# EAGLE design main (EAGLE 6.5.0)
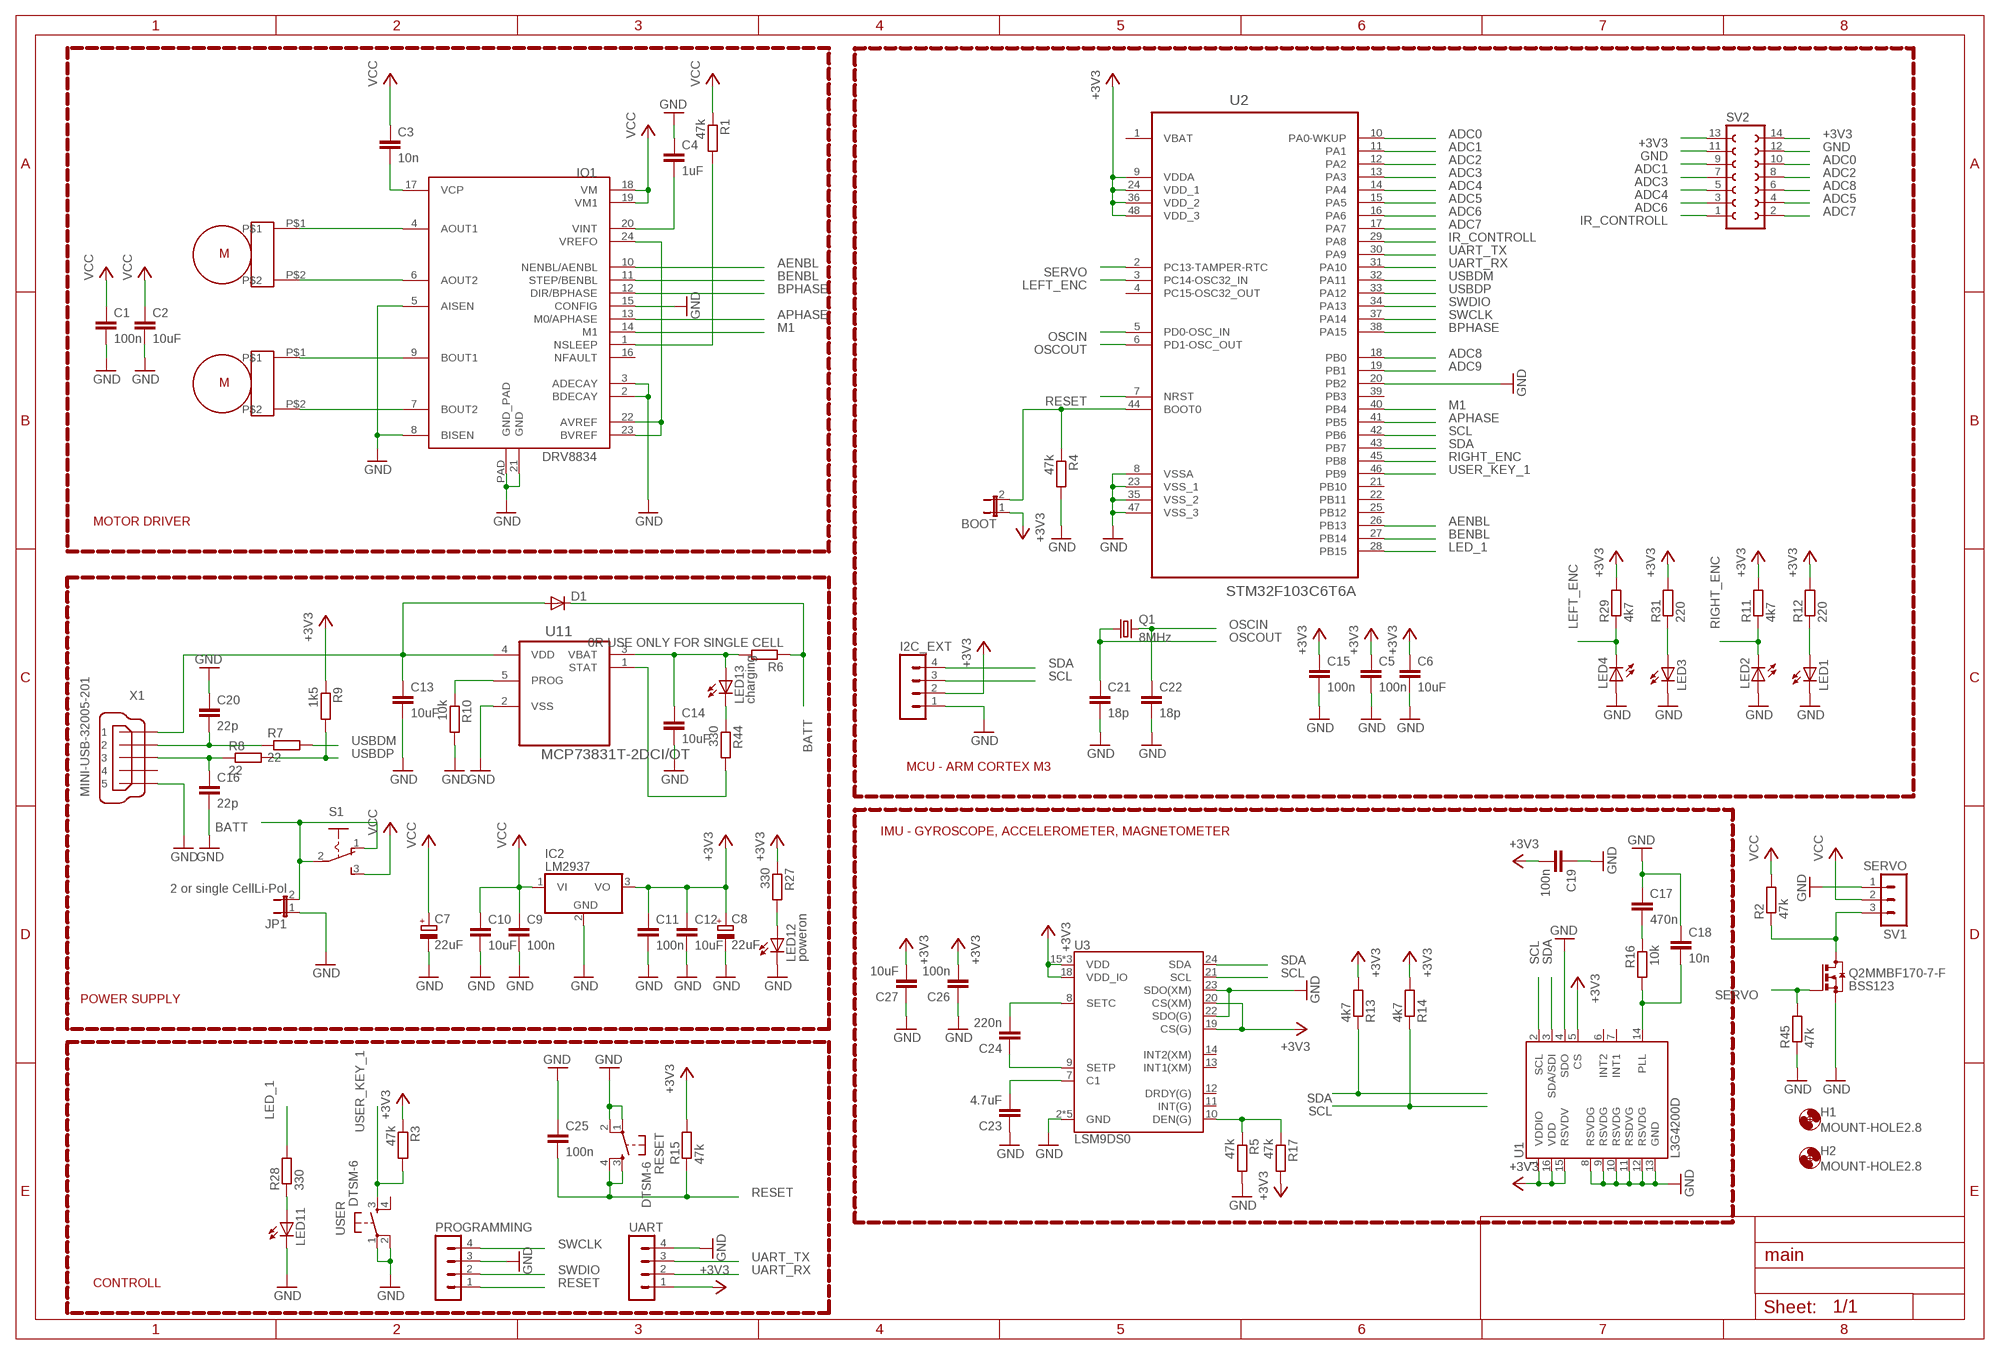
[diagram p0: schematic, sheet 1, part 1 of 2]
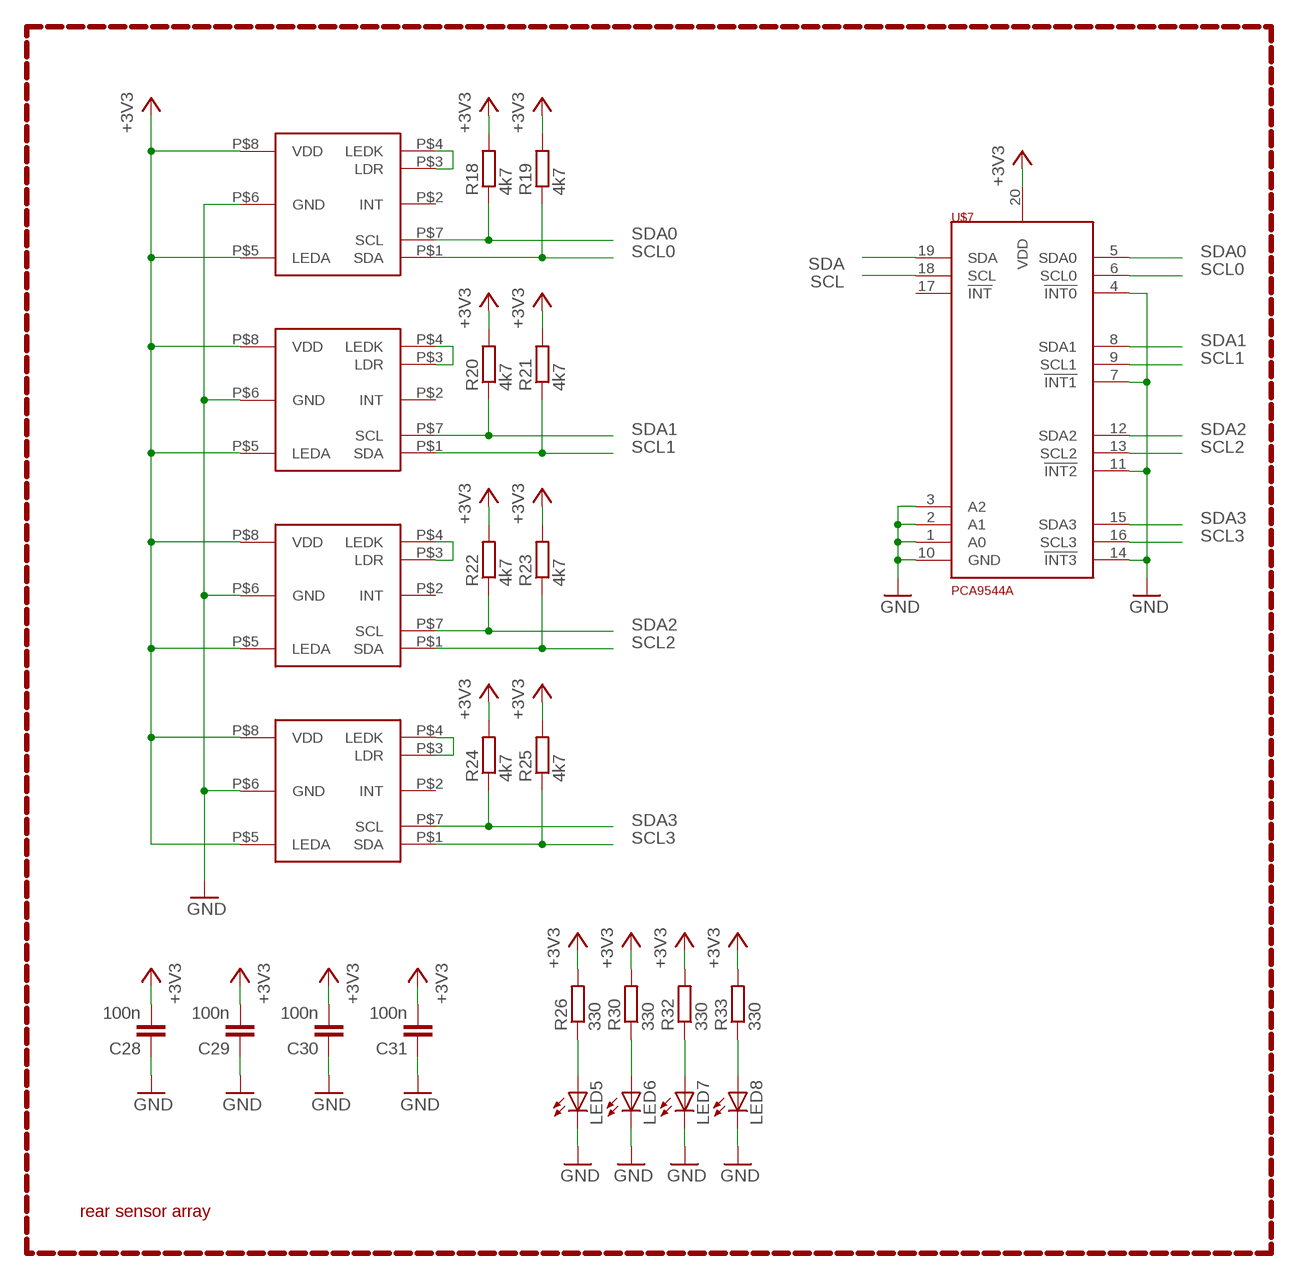
[diagram p1: schematic, sheet 1, part 2 of 2]

## Parts
BOOT  JP1E  [JP1]
C1  100n  C-EUC1206  [C1206]
C2  10uF  C-EUC1206  [C1206]
C3  10n  C-EUC1206  [C1206]
C4  1uF  C-EUC1206  [C1206]
C5  100n  C-EUC0805  [C0805]
C6  10uF  C-EUC0805  [C0805]
C7  22uF  CPOL-EU153CLV-0505  [153CLV-0505]
C8  22uF  CPOL-EU153CLV-0505  [153CLV-0505]
C9  100n  C-EUC0805  [C0805]
C10  10uF  C-EUC0805  [C0805]
C11  100n  C-EUC0805  [C0805]
C12  10uF  C-EUC0805  [C0805]
C13  10uF  C-EUC0805  [C0805]
C14  10uF  C-EUC0805  [C0805]
C15  100n  C-EUC0805  [C0805]
C16  22p  C-EUC0805  [C0805]
C17  470n  C-EUC0805  [C0805]
C18  10n  C-EUC0805  [C0805]
C19  100n  C-EUC0805  [C0805]
C20  22p  C-EUC0805  [C0805]
C21  18p  C-EUC0805  [C0805]
C22  18p  C-EUC0805  [C0805]
C23  4.7uF  C-EUC0805  [C0805]
C24  220n  C-EUC0805  [C0805]
C25  100n  C-EUC0805  [C0805]
C26  100n  C-EUC0805  [C0805]
C27  10uF  C-EUC0805  [C0805]
C28  100n  C-EUC0805  [C0805]
C29  100n  C-EUC0805  [C0805]
C30  100n  C-EUC0805  [C0805]
C31  100n  C-EUC0805  [C0805]
D1  DIODE-SMB  [SMB]
H1  MOUNT-HOLE2.8  [2,8]
H2  MOUNT-HOLE2.8  [2,8]
I2C_EXT  MA04-1  [MA04-1]
IC2  LM2937  [TO263-3]
IO1  DRV8834  [DRV8834_PCK]
JP1  2 or single CellLi-Pol  JP1E  [JP1]
LED1  LEDCHIPLED_1206  [CHIPLED_1206]
LED2  LEDCHIPLED_1206  [CHIPLED_1206]
LED3  LEDCHIPLED_1206  [CHIPLED_1206]
LED4  LEDCHIPLED_1206  [CHIPLED_1206]
LED5  LEDCHIPLED_1206  [CHIPLED_1206]
LED6  LEDCHIPLED_1206  [CHIPLED_1206]
LED7  LEDCHIPLED_1206  [CHIPLED_1206]
LED8  LEDCHIPLED_1206  [CHIPLED_1206]
LED11  LEDCHIPLED_1206  [CHIPLED_1206]
LED12  poweron  LEDCHIPLED_1206  [CHIPLED_1206]
LED13  charging  LEDCHIPLED_1206  [CHIPLED_1206]
PROGRAMMING  MA04-1  [MA04-1]
Q1  8MHz  CRYSTALCTS406  [CTS406]
Q2MMBF170-7-F  BSS123  [SOT23]
R1  47k  R-EU_M1206  [M1206]
R2  47k  R-EU_M0805  [M0805]
R3  47k  R-EU_M0805  [M0805]
R4  47k  R-EU_M0805  [M0805]
R5  47k  R-EU_M0805  [M0805]
R6  0R USE ONLY FOR SINGLE CELL  R-EU_M1206  [M1206]
R7  22  R-EU_M0805  [M0805]
R8  22  R-EU_M0805  [M0805]
R9  1k5  R-EU_M0805  [M0805]
R10  10k  R-EU_M0805  [M0805]
R11  4k7  R-EU_M0805  [M0805]
R12  220  R-EU_M0805  [M0805]
R13  4k7  R-EU_M0805  [M0805]
R14  4k7  R-EU_M0805  [M0805]
R15  47k  R-EU_M0805  [M0805]
R16  10k  R-EU_M0805  [M0805]
R17  47k  R-EU_M0805  [M0805]
R18  4k7  R-EU_M0805  [M0805]
R19  4k7  R-EU_M0805  [M0805]
R20  4k7  R-EU_M0805  [M0805]
R21  4k7  R-EU_M0805  [M0805]
R22  4k7  R-EU_M0805  [M0805]
R23  4k7  R-EU_M0805  [M0805]
R24  4k7  R-EU_M0805  [M0805]
R25  4k7  R-EU_M0805  [M0805]
R26  330  R-EU_M0805  [M0805]
R27  330  R-EU_M0805  [M0805]
R28  330  R-EU_M0805  [M0805]
R29  4k7  R-EU_M0805  [M0805]
R30  330  R-EU_M0805  [M0805]
R31  220  R-EU_M0805  [M0805]
R32  330  R-EU_M0805  [M0805]
R33  330  R-EU_M0805  [M0805]
R44  330  R-EU_M0805  [M0805]
R45  47k  R-EU_M0805  [M0805]
RESET  DTSM-6  [DTSM-6]
S1  255SB  [255SB]
SV1  SERVO  MA03-1  [MA03-1]
SV2  FE07-2  [FE07-2]
U1  L3G4200D  [LGA16-4X4]
U2  STM32F103C6T6A  [QFP50P900X900X160-48N]
U3  LSM9DS0  [LGA-24]
U11  MCP73831T-2DCI/OT  [SOT95P270X145-5N]
U$1  MICRO_METAL_GEAR_MOTOR  [MICRO_METAL_GEAR_MOTOR]
U$2  MICRO_METAL_GEAR_MOTOR  [MICRO_METAL_GEAR_MOTOR]
U$3  APDS9950  [APDS9950]
U$4  APDS9950  [APDS9950]
U$5  APDS9950  [APDS9950]
U$6  APDS9950  [APDS9950]
U$7  DSSCIRCUITS_PCA9544A  [DSSCIRCUITS_TSSOP20]
UART  MA04-1  [MA04-1]
USER  DTSM-6  [DTSM-6]
X1  MINI-USB-32005-201  [32005-201]

## Nets
+3V3: BOOT.1 C5.1 C6.1 C8.+ C11.1 C12.1 C15.1 C19.2 C26.2 C27.2 C28.2 C29.2 C30.2 C31.2 I2C_EXT.2 IC2.3(VO) R3.1 R9.1 R11.2 R12.2 R13.2 R14.2 R15.2 R17.2 R18.2 R19.2 R20.2 R21.2 R22.2 R23.2 R24.2 R25.2 R26.2 R27.1 R29.2 R30.2 R31.2 R32.2 R33.2 SV2.13 SV2.14 U1.1(VDDIO) U1.5(CS) U1.15(RSVDV) U1.16(VDD) U2.9(VDDA) U2.24(VDD_1) U2.36(VDD_2) U2.48(VDD_3) U3.15(VDD) U3.16(VDD) U3.17(VDD) U3.18(VDD_IO) U3.19(CS(G)) U3.20(CS(XM)) U$3.P$5(LEDA) U$3.P$8(VDD) U$4.P$5(LEDA) U$4.P$8(VDD) U$5.P$5(LEDA) U$5.P$8(VDD) U$6.P$5(LEDA) U$6.P$8(VDD) U$7.20(VDD) UART.1
ADC0: SV2.10 U2.10(PA0-WKUP)
ADC1: SV2.9 U2.11(PA1)
ADC2: SV2.8 U2.12(PA2)
ADC3: SV2.7 U2.13(PA3)
ADC4: SV2.5 U2.14(PA4)
ADC5: SV2.4 U2.15(PA5)
ADC6: SV2.3 U2.16(PA6)
ADC7: SV2.2 U2.17(PA7)
ADC8: SV2.6 U2.18(PB0)
ADC9: U2.19(PB1)
AENBL: IO1.10(NENBL/AENBL) U2.26(PB13)
APHASE: IO1.13(M0/APHASE) U2.41(PB5)
BATT: D1.C JP1.2 R6.1 S1.1(O) S1.2(P)
BENBL: IO1.11(STEP/BENBL) U2.27(PB14)
BPHASE: IO1.12(DIR/BPHASE) U2.38(PA15)
GND: C1.2 C2.2 C4.1 C5.2 C6.2 C7.- C8.- C9.2 C10.2 C11.2 C12.2 C13.2 C14.2 C15.2 C16.2 C17.1 C18.1 C19.1 C20.1 C21.2 C22.2 C23.1 C25.1 C26.1 C27.1 C28.1 C29.1 C30.1 C31.1 I2C_EXT.1 IC2.2(GND) IO1.2(BDECAY) IO1.3(ADECAY) IO1.5(AISEN) IO1.8(BISEN) IO1.15(CONFIG) IO1.21(GND) IO1.PAD(GND_PAD) JP1.1 LED1.C LED2.A LED3.C LED4.A LED5.C LED6.C LED7.C LED8.C LED11.C LED12.C PROGRAMMING.3 Q2MMBF170-7-F.2(S) R4.2 R5.2 R10.2 R45.1 RESET.1 RESET.2 SV1.1 SV2.11 SV2.12 U1.4(SDO) U1.8(RSVDG) U1.9(RSVDG) U1.10(RSVDG) U1.11(RSDVG) U1.12(RSVDG) U1.13(GND) U2.8(VSSA) U2.20(PB2) U2.23(VSS_1) U2.35(VSS_2) U2.47(VSS_3) U3.2(GND) U3.3(GND) U3.4(GND) U3.5(GND) U3.6(GND) U3.22(SDO(G)) U3.23(SDO(XM)) U11.2(VSS) U$3.P$6(GND) U$4.P$6(GND) U$5.P$6(GND) U$6.P$6(GND) U$7.1(A0) U$7.2(A1) U$7.3(A2) U$7.4(!INT0) U$7.7(!INT1) U$7.10(GND) U$7.11(!INT2) U$7.14(!INT3) UART.4 USER.1 USER.2 X1.5
IR_CONTROLL: SV2.1 U2.29(PA8)
LED_1: R28.2 U2.28(PB15)
LEFT_ENC: LED4.C R29.1 U2.3(PC14-OSC32_IN)
M1: IO1.14(M1) U2.40(PB4)
N$1: IO1.4(AOUT1) U$1.P$1
N$2: IO1.6(AOUT2) U$1.P$2
N$3: IO1.9(BOUT1) U$2.P$1
N$4: IO1.7(BOUT2) U$2.P$2
N$5: C3.2 IO1.17(VCP)
N$6: C23.2 U3.7(C1)
N$7: C24.2 U3.8(SETC)
N$8: IO1.22(AVREF) IO1.23(BVREF) IO1.24(VREFO)
N$9: IO1.1(NSLEEP) R1.2
N$13: C24.1 U3.9(SETP)
N$14: LED3.A R31.1
N$15: LED1.A R12.1
N$16: BOOT.2 R4.1 U2.44(BOOT0)
N$17: R44.2 U11.1(STAT)
N$18: R5.1 R17.1 U3.10(DEN(G))
N$19: C18.2 R16.2 U1.14(PLL)
N$20: C17.2 R16.1
N$21: U$6.P$3(LDR) U$6.P$4(LEDK)
N$22: C4.2 IO1.20(VINT)
N$23: LED12.A R27.2
N$24: LED13.C R44.1
N$25: U$5.P$3(LDR) U$5.P$4(LEDK)
N$26: Q2MMBF170-7-F.3(D) R2.1 SV1.3
N$27: U$4.P$3(LDR) U$4.P$4(LEDK)
N$28: U$3.P$3(LDR) U$3.P$4(LEDK)
N$33: LED11.A R28.1
N$38: LED5.A R26.1
N$39: LED6.A R30.1
N$40: LED7.A R32.1
N$41: LED8.A R33.1
N$53: C14.1 LED13.A R6.2 U11.3(VBAT)
N$54: R10.1 U11.5(PROG)
N$55: C20.2 R7.1 X1.2
N$56: C16.1 R8.1 X1.3
N$57: C13.1 D1.A U11.4(VDD) X1.1
OSCIN: C22.1 Q1.3 U2.5(PD0-OSC_IN)
OSCOUT: C21.1 Q1.1 U2.6(PD1-OSC_OUT)
RESET: C25.2 PROGRAMMING.1 R15.1 RESET.3 RESET.4 U2.7(NRST)
RIGHT_ENC: LED2.C R11.1 U2.45(PB8)
SCL: I2C_EXT.3 R14.1 U1.2(SCL) U2.42(PB6) U3.21(SCL) U$7.18(SCL)
SCL0: R19.1 U$3.P$1(SDA) U$7.6(SCL0)
SCL1: R21.1 U$4.P$1(SDA) U$7.9(SCL1)
SCL2: R23.1 U$5.P$1(SDA) U$7.13(SCL2)
SCL3: R25.1 U$6.P$1(SDA) U$7.16(SCL3)
SDA: I2C_EXT.4 R13.1 U1.3(SDA/SDI) U2.43(PB7) U3.24(SDA) U$7.19(SDA)
SDA0: R18.1 U$3.P$7(SCL) U$7.5(SDA0)
SDA1: R20.1 U$4.P$7(SCL) U$7.8(SDA1)
SDA2: R22.1 U$5.P$7(SCL) U$7.12(SDA2)
SDA3: R24.1 U$6.P$7(SCL) U$7.15(SDA3)
SERVO: Q2MMBF170-7-F.1(G) R45.2 U2.2(PC13-TAMPER-RTC)
SWCLK: PROGRAMMING.4 U2.37(PA14)
SWDIO: PROGRAMMING.2 U2.34(PA13)
UART_RX: U2.31(PA10) UART.2
UART_TX: U2.30(PA9) UART.3
USBDM: R7.2 U2.32(PA11)
USBDP: R8.2 R9.2 U2.33(PA12)
USER_KEY_1: R3.2 U2.46(PB9) USER.3
VCC: C1.1 C2.1 C3.1 C7.+ C9.1 C10.1 IC2.1(VI) IO1.18(VM) IO1.19(VM1) R1.1 R2.2 S1.3(S) SV1.2
Unconnected: IO1.16(NFAULT) U1.6(INT2) U1.7(INT1) U2.4(PC15-OSC32_OUT) U2.21(PB10) U2.22(PB11) U2.25(PB12) U2.39(PB3) U3.11(INT(G)) U3.12(DRDY(G)) U3.13(INT1(XM)) U3.14(INT2(XM)) U$3.P$2(INT) U$4.P$2(INT) U$5.P$2(INT) U$6.P$2(INT) U$7.17(!INT) USER.4 X1.4

## Notes on the sheet
- MOTOR DRIVER
- MCU - ARM CORTEX M3
- IMU - GYROSCOPE, ACCELEROMETER, MAGNETOMETER
- rear sensor array
- POWER SUPPLY
- CONTROLL

## Power pins joined to a net without a drawn wire
VBAT: U2.1(VBAT)

## Library data of the parts
BOOT JP1 = jumper:JP1E: JUMPER
C1-C6 C9-C31 = resistor:C-EU: CAPACITOR, European symbol
C7 C8 = resistor:CPOL-EU: POLARIZED CAPACITOR, European symbol
D1 = diode:DIODE-: DIODE
H1 H2 = holes:MOUNT-HOLE: MOUNTING HOLE with drill center marker
I2C_EXT PROGRAMMING UART = con-lstb:MA04-1: PIN HEADER; OC_FARNELL: unknown; OC_NEWARK: unknown
IC2 = linear:LM2937: LM2937-2.5, LM2937-3.3 400mA and 500mA Voltage Regulators Source: http://cache.national.com/ds/LM/LM2937-2.5.pdf
IO1 = yellow_car:DRV8834
LED1-LED8 LED11-LED13 = led:LED: LED OSRAM: - CHIPLED LG R971, LG N971, LY N971, LG Q971, LY Q971, LO R971, LY R971 LH N974, LH R974 LS Q976, LO Q976, LY Q976 LO Q996 - Hyper CHIPLED LW Q18S LB Q993, LB Q99A, LB R99A - SideLED LS A670, LO A670, LY A670, LG A670, LP A670 LB A673, LV A673, LT A673, LW A673 LH A674 LY A675 LS A676, LA A676, LO A676, LY A676, LW A676 LS A679, LY A679, LG A679 - Hyper Micro SIDELED® LS Y876, LA Y876, LO Y876, LY Y876 LT Y87S - SmartLED LW L88C, LW L88S LB L89C, LB L89S, LG L890 LS L89K, LO L89K, LY L89K LS L896, LA L896, LO L896, LY L896 - TOPLED LS T670, LO T670, LY T670, LG T670, LP T670 LSG T670, LSP T670, LSY T670, LOP T670, LYG T670 LG T671, LOG T671, LSG T671 LB T673, LV T673, LT T673, LW T673 LH T674 LS T676, LA T676, LO T676, LY T676, LB T676, LH T676, LSB T676, LW T676 LB T67C, LV T67C, LT T67C, LS T67K, LO T67K, LY T67K, LW E67C LS E67B, LA E67B, LO E67B, LY E67B, LB E67C, LV E67C, LT E67C LW T67C LS T679, LY T679, LG T679 LS T770, LO T770, LY T770, LG T770, LP T770 LB T773, LV T773, LT T773, LW T773 LH T774 LS E675, LA E675, LY E675, LS T675 LS T776, LA T776, LO T776, LY T776, LB T776 LHGB T686 LT T68C, LB T68C - Hyper Mini TOPLED® LB M676 - Mini TOPLED Santana® LG M470 LS M47K, LO M47K, LY M47K Source: http://www.osram.convergy.de LUXEON: - LUMILED® LXK2-PW12-R00, LXK2-PW12-S00, LXK2-PW14-U00, LXK2-PW14-V00 LXK2-PM12-R00, LXK2-PM12-S00, LXK2-PM14-U00 LXK2-PE12-Q00, LXK2-PE12-R00, LXK2-PE12-S00, LXK2-PE14-T00, LXK2-PE14-U00 LXK2-PB12-K00, LXK2-PB12-L00, LXK2-PB12-M00, LXK2-PB14-N00, LXK2-PB14-P00, LXK2-PB14-Q00 LXK2-PR12-L00, LXK2-PR12-M00, LXK2-PR14-Q00, LXK2-PR14-R00 LXK2-PD12-Q00, LXK2-PD12-R00, LXK2-PD12-S00 LXK2-PH12-R00, LXK2-PH12-S00 LXK2-PL12-P00, LXK2-PL12-Q00, LXK2-PL12-R00 Source: www.luxeon.com KINGBRIGHT: KA-3528ASYC Source: www.kingbright.com
Q1 = crystal:CRYSTAL: CRYSTAL; OC_FARNELL: unknown; OC_NEWARK: unknown
Q2MMBF170-7-F = transistor-small-signal:BSS123: N-CHANNEL MOS FET
R1-R33 R44 R45 = resistor:R-EU_: RESISTOR, European symbol
RESET USER = switch-tact:DTSM-6
S1 = switch:255SB: SLIDING SWITCH Distributor Buerklin, 11G810
SV1 = con-lstb:MA03-1: PIN HEADER; OC_FARNELL: unknown; OC_NEWARK: unknown
SV2 = con-lsta:FE07-2: FEMALE HEADER; OC_FARNELL: unknown; OC_NEWARK: unknown
U1 = my_parts:L3G4200D: L3G4200D Three-axis, digital output gyroscope The L3G4200D is a low-power three-axis angular rate sensor, has a full scale of ±250/±500/±2000 dps and is capable of measuring rates with a user-selectable bandwidth. It includes a sensing element and an IC interface capable of providing the measured angular rate to the external world through a digital interface (I2C/SPI). Package: 4x4x1.1 LGA-16 (LGA16-4x4.PAC)
U2 = stm32f103_lqfp48:STM32F103C6T6A: MCU, 32BIT, 32K FLASH, 48LQFP; MPN: STM32F103C6T6A; OC_FARNELL: 1972391; OC_NEWARK: 72T2643; PACKAGE: 48LQFP; SUPPLIER: STMicroelectronics
U3 = SparkFun-DigitalIC:LSM9DS0: LSM9DS0 3D Accelerometer, 3D Gyroscope, 3D Magnetomter Features: 3 acceleration channels, 3 angular rate channels, 3 magnetic field channels ±2/±4/±6/±8/±16 g linear acceleration full scale ±2/±4/±8/±12 gauss magnetic full scale ±245/±500/±2000 dps angular rate full scale 16-bit data output SPI / I2C serial interfaces Analog supply voltage 2.4 V to 3.6 V Power-down mode / low-power mode Programmable interrupt generators Embedded self-test Embedded temperature sensor Embedded FIFO Position and motion detection functions Click/double-click recognition
U11 = Microchip-MCP73831T-2DCI_OT:MCP73831T-2DCI/OT: Li-Polymer Charge Management Controllers, SOT23-5; MPN: MCP73831T-2DCI/OT; OC_FARNELL: 1840935; OC_NEWARK: 84R6271; PACKAGE: SOT23-5; SUPPLIER: Microchip
U$1 U$2 = pololu:MICRO_METAL_GEAR_MOTOR
U$3-U$6 = my_parts:APDS9950
U$7 = PCA9544A Breakout PCB:DSSCIRCUITS_PCA9544A
X1 = con-cypressindustries:MINI-USB-: MINI USB-B Conector Source: www.cypressindustries.com; OC_FARNELL: unknown; OC_NEWARK: unknown

## Board
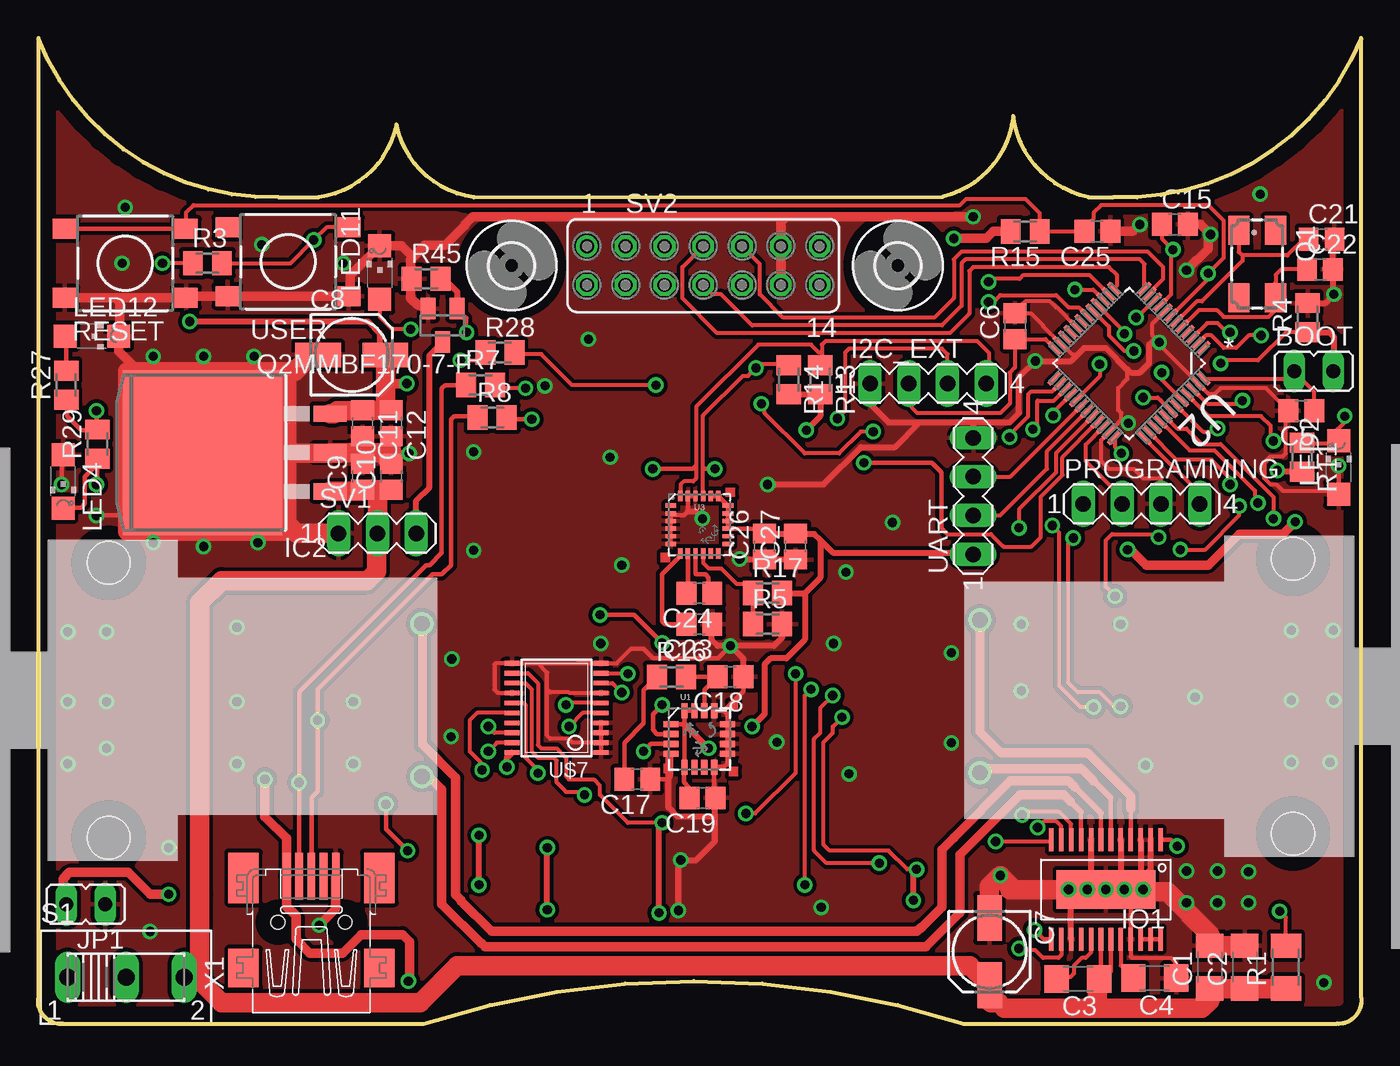
[diagram p2: board, top side]
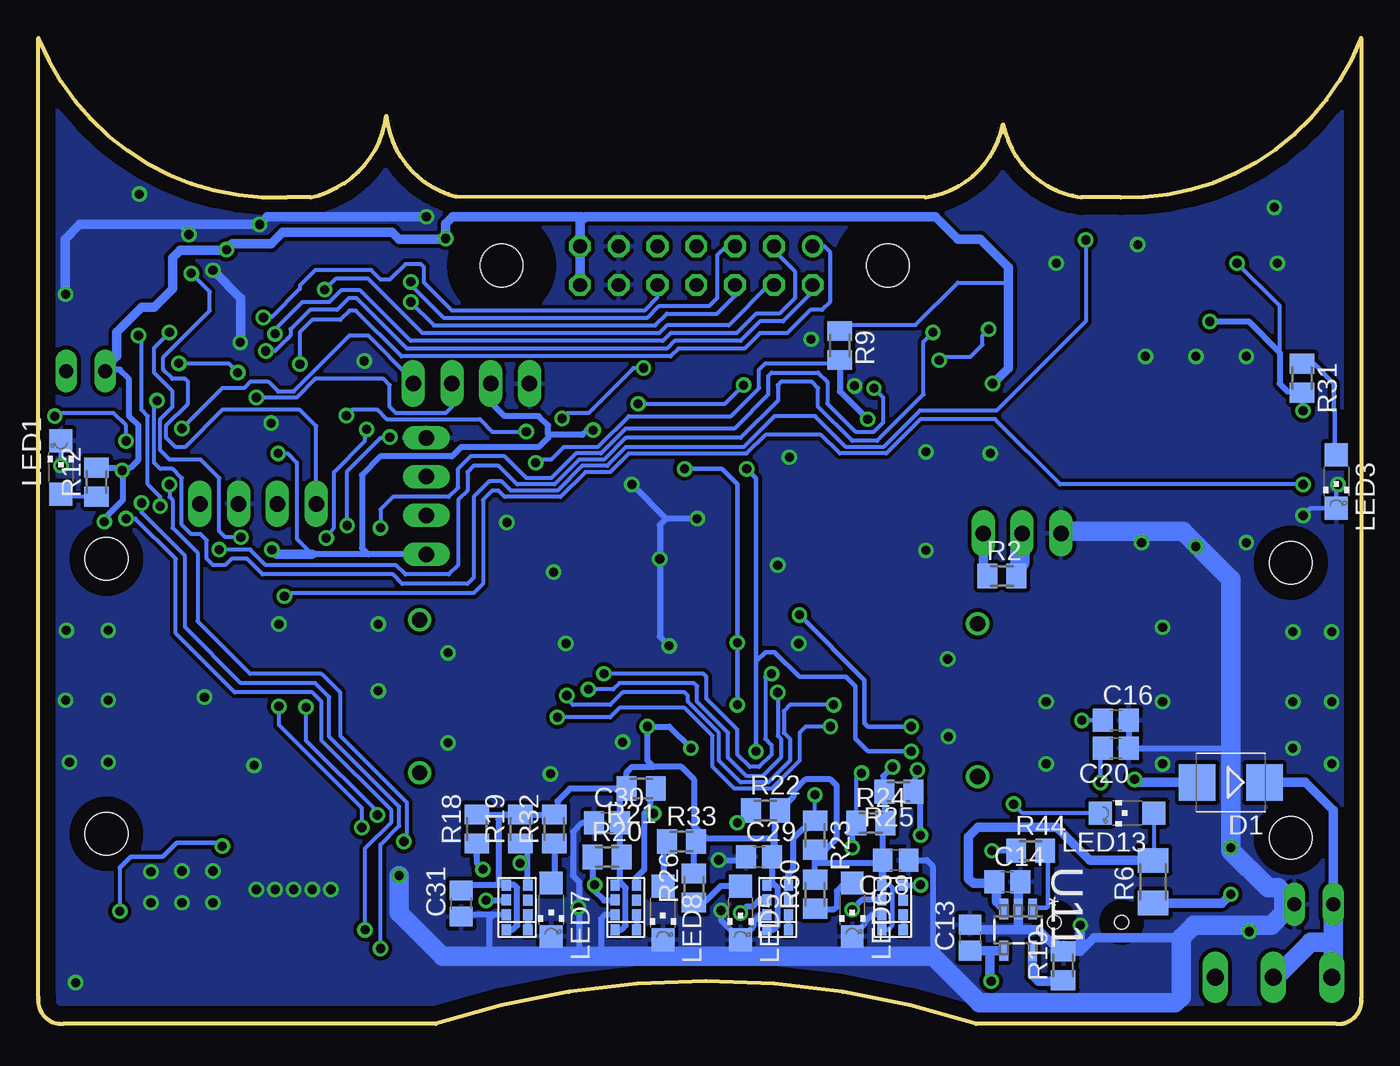
[diagram p3: board, bottom side, seen from below]

Size 86.64 x 64.52 mm. Coordinates in mm from the lower left corner, seen from the top.
Outline: 1.64,0.01 25.23,0.01 arc-36 60.61,0.01 85,0.01 arc103 86.62,1.76 86.62,64.52 arc-71 70.37,54.11 68.79,54.11 arc-71 63.84,59.44 arc-71 59.24,54.16 28.53,54.11 arc-71 23.45,58.88 arc-71 18.35,54.11 15.76,54.11 arc-71 0.01,64.52 0.01,1.68 arc103 1.64,0.01
Copper layers (1*16): Top 0.035mm / dielectric 1.5mm / Bottom 0.035mm
Design rules "default *": minimum track width 10mil, minimum drill 24mil, track to track 10mil, track to pad 10mil, pad to pad 10mil, via to via 10mil, smd to smd 10mil, copper to edge 40mil, drill to drill 8mil, minimum pad ring 10mil, minimum via ring 8mil, stop-mask expansion 4mil, vias tented up to drill 0mil, thermal gap 10mil

### Footprints (pad centres in the part's own frame; a part is rotated, then mirrored left to right if it is on the bottom)
JP1 = drill 0.914 long: 1 0,-1.27; 2 0,1.27
C1206 = smd 1.6 x 1.8: 1 -1.4,0; 2 1.4,0
C0805 = smd 1.3 x 1.5: 1 -0.85,0; 2 0.85,0
153CLV-0505 = smd 3 x 1.6: + 2.2,0; - -2.2,0
SMB = smd 2.4 x 2.4: A 2.2,0; C -2.2,0
2,8 = hole 2.8: 0,0
MA04-1 = drill 1.016 long: 1 -3.81,0; 2 -1.27,0; 3 1.27,0; 4 3.81,0
TO263-3 = smd 1.067 x 2.159: 1 -2.54,-5.791; 2 0,-5.791; 3 2.54,-5.791 | smd 10.8 x 10.41: TAB 0,2.54
DRV8834_PCK = smd 0.3 x 1.5: 1 -3.575,-3.25; 2 -2.925,-3.25; 3 -2.275,-3.25; 4 -1.625,-3.25; 5 -0.975,-3.25; 6 -0.325,-3.25; 7 0.325,-3.25; 8 0.975,-3.25; 9 1.625,-3.25; 10 2.275,-3.25; 11 2.925,-3.25; 12 3.575,-3.25; 13 3.575,3.25; 14 2.925,3.25; 15 2.275,3.25; 16 1.625,3.25; 17 0.975,3.25; 18 0.325,3.25; 19 -0.325,3.25; 20 -0.975,3.25; 21 -1.625,3.25; 22 -2.275,3.25; 23 -2.925,3.25; 24 -3.575,3.25 | smd 6.452 x 2.54: PAD 0,0
CHIPLED_1206 = smd 1.5 x 1.5: A 0,-1.75; C 0,1.75
CTS406 = smd 1.9 x 1.4: 1 -2.2,-1.2; 2 2.2,-1.2; 3 2.2,1.2; 4 -2.2,1.2
SOT23 = smd 1 x 1.4: 1 -0.95,-1.1; 2 0.95,-1.1; 3 0,1.1
M1206 = smd 1.6 x 2: 1 -1.4,0; 2 1.4,0
M0805 = smd 1.3 x 1.6: 1 -0.95,0; 2 0.95,0
DTSM-6 = smd 1.55 x 1.3: 1 -3.975,2.25; 2 3.975,2.25; 3 -3.975,-2.25; 4 3.975,-2.25
255SB = drill 1.118 long: 1 -3.81,0; 2 0,0; 3 3.81,0
MA03-1 = drill 1.016 long: 1 -2.54,0; 2 0,0; 3 2.54,0
FE07-2 = drill 0.914: 1 -7.62,1.27 | drill 0.914 octagon: 2 -7.62,-1.27; 3 -5.08,1.27; 4 -5.08,-1.27; 5 -2.54,1.27; 6 -2.54,-1.27; 7 0,1.27; 8 0,-1.27; 9 2.54,1.27; 10 2.54,-1.27; 11 5.08,1.27; 12 5.08,-1.27; 13 7.62,1.27; 14 7.62,-1.27
LGA16-4X4 = smd 1 x 0.4: 1 -1.85,0.975; 2 -1.85,0.325; 3 -1.85,-0.325; 4 -1.85,-0.975; 9 1.85,-0.975; 10 1.85,-0.325; 11 1.85,0.325; 12 1.85,0.975 | smd 0.4 x 1: 5 -0.975,-1.85; 6 -0.325,-1.85; 7 0.325,-1.85; 8 0.975,-1.85; 13 0.975,1.85; 14 0.325,1.85; 15 -0.325,1.85; 16 -0.975,1.85
QFP50P900X900X160-48N = smd 1.041 x 0.279: 1 -4.166,2.743; 2 -4.166,2.261; 3 -4.166,1.753; 4 -4.166,1.245; 5 -4.166,0.762; 6 -4.166,0.254; 7 -4.166,-0.254; 8 -4.166,-0.762; 9 -4.166,-1.245; 10 -4.166,-1.753; 11 -4.166,-2.261; 12 -4.166,-2.743; 25 4.166,-2.743; 26 4.166,-2.261; 27 4.166,-1.753; 28 4.166,-1.245; 29 4.166,-0.762; 30 4.166,-0.254; 31 4.166,0.254; 32 4.166,0.762; 33 4.166,1.245; 34 4.166,1.753; 35 4.166,2.261; 36 4.166,2.743 | smd 0.279 x 1.041: 13 -2.743,-4.166; 14 -2.261,-4.166; 15 -1.753,-4.166; 16 -1.245,-4.166; 17 -0.762,-4.166; 18 -0.254,-4.166; 19 0.254,-4.166; 20 0.762,-4.166; 21 1.245,-4.166; 22 1.753,-4.166; 23 2.261,-4.166; 24 2.743,-4.166; 37 2.743,4.166; 38 2.261,4.166; 39 1.753,4.166; 40 1.245,4.166; 41 0.762,4.166; 42 0.254,4.166; 43 -0.254,4.166; 44 -0.762,4.166; 45 -1.245,4.166; 46 -1.753,4.166; 47 -2.261,4.166; 48 -2.743,4.166
LGA-24 = smd 0.7 x 0.29: 1 -1.875,1.25; 2 -1.875,0.75; 3 -1.875,0.25; 4 -1.875,-0.25; 5 -1.875,-0.75; 6 -1.875,-1.25; 13 1.875,-1.25; 14 1.875,-0.75; 15 1.875,-0.25; 16 1.875,0.25; 17 1.875,0.75; 18 1.875,1.25 | smd 0.29 x 0.7: 7 -1.25,-1.875; 8 -0.75,-1.875; 9 -0.25,-1.875; 10 0.25,-1.875; 11 0.75,-1.875; 12 1.25,-1.875; 19 1.25,1.875; 20 0.75,1.875; 21 0.25,1.875; 22 -0.25,1.875; 23 -0.75,1.875; 24 -1.25,1.875
SOT95P270X145-5N = smd 1.321 x 0.559: 1 -1.372,0.94; 2 -1.372,0; 3 -1.372,-0.94; 4 1.372,-0.94; 5 1.372,0.94
MICRO_METAL_GEAR_MOTOR = drill 1: P$1 -5,1; P$2 5,1 | hole 2.8: -9,21.5; 9,21.5
APDS9950 = smd 0.6 x 0.72: P$1 0.7,1.4; P$2 0.7,0.43; P$3 0.7,-0.54; P$4 0.7,-1.51; P$5 -0.7,-1.5; P$6 -0.7,-0.53; P$7 -0.7,0.44; P$8 -0.7,1.41
DSSCIRCUITS_TSSOP20 = smd 0.305 x 0.991: 1 -2.925,-2.918; 2 -2.275,-2.918; 3 -1.625,-2.918; 4 -0.975,-2.918; 5 -0.325,-2.918; 6 0.325,-2.918; 7 0.975,-2.918; 8 1.625,-2.918; 9 2.275,-2.918; 10 2.925,-2.918; 11 2.925,2.918; 12 2.275,2.918; 13 1.625,2.918; 14 0.975,2.918; 15 0.325,2.918; 16 -0.325,2.918; 17 -0.975,2.918; 18 -1.625,2.918; 19 -2.275,2.918; 20 -2.925,2.918
32005-201 = smd 3.1 x 0.5: 1 3,1.6; 2 3,0.8; 3 3,0; 4 3,-0.8; 5 3,-1.6 | smd 2.5 x 2: M1 -3,-4.45; M2 -3,4.45 | smd 3.3 x 2: M3 2.9,4.45; M4 2.9,-4.45 | hole 0.9: 0,2.2; 0,-2.2

### Placement (x,y rotation side)
BOOT  83.53,42.73 270 top
C1  76.72,3.72 90 top
C2  79,3.72 90 top
C3  68.08,2.95 180 top
C4  73.11,3 180 top
C5  82.71,40.14 180 top
C6  63.97,45.68 90 top
C7  62.29,4.73 270 top
C8  20.53,43.8 0 top
C9  21.25,35.82 90 top
C10  23.12,35.82 90 top
C11  21.25,39.33 270 top
C12  23.12,39.33 270 top
C13  25.61,5.65 90 bottom
C14  23.18,9.3 0 bottom
C15  74.43,52.33 0 top
C16  16.06,19.87 0 bottom
C17  39.23,16.01 180 top
C18  45.32,22.71 180 top
C19  43.5,14.79 180 top
C20  16.06,18.04 180 bottom
C21  84.03,51.37 0 top
C22  83.93,49.38 0 top
C23  43.29,26.17 180 top
C24  43.29,28.2 180 top
C25  69.35,51.87 180 top
C26  47.56,31.25 90 top
C27  49.59,31.25 90 top
C28  30.49,10.73 180 bottom
C29  39.43,10.93 0 bottom
C30  49.39,13.16 0 bottom
C31  58.94,7.88 90 bottom
D1  8.55,15.81 180 bottom
H1  31,49.64 0 top
H2  56.3,49.64 0 top
I2C_EXT  58.28,41.92 0 top
IC2  13.32,37.4 90 top
IO1  69.91,8.8 180 top
JP1  3.11,7.83 90 top
LED1  85.15,36.43 0 bottom
LED2  85.15,36.43 0 top
LED3  1.64,35.52 180 bottom
LED4  1.64,35.52 180 top
LED5  40.65,7.27 180 bottom
LED6  33.34,7.47 180 bottom
LED7  53.05,7.47 180 bottom
LED8  45.73,7.27 180 bottom
LED11  22.36,49.18 0 top
LED12  3.52,45.02 270 top
LED13  15.33,13.8 90 bottom
PROGRAMMING  72.25,34.04 0 top
Q1  79.82,49.74 270 top
Q2MMBF170-7-F  26.48,45.73 180 top
R1  81.7,3.72 90 top
R2  23.53,29.32 0 bottom
R3  11.09,49.79 0 top
R4  83.12,46.23 90 top
R5  47.76,26.17 0 top
R6  13.63,9.3 90 bottom
R7  28.97,41.82 0 top
R8  29.73,39.68 0 top
R9  34.15,44.41 270 bottom
R10  19.52,3.82 90 bottom
R11  82.76,37.09 270 top
R12  82.81,35.47 90 bottom
R13  51.22,42.17 270 top
R14  49.13,42.17 270 top
R15  64.63,51.87 180 top
R16  41.46,22.71 0 top
R17  47.76,28.2 0 top
R18  57.92,12.76 90 bottom
R19  55.08,12.76 90 bottom
R20  49.39,10.93 0 bottom
R21  47.15,15.4 180 bottom
R22  39.03,13.98 0 bottom
R23  35.77,12.35 270 bottom
R24  32.12,13.16 0 bottom
R25  30.29,15.2 180 bottom
R26  43.7,8.9 90 bottom
R27  1.84,41.82 90 top
R28  30.24,43.95 0 top
R29  3.87,37.95 90 top
R30  35.77,8.49 90 bottom
R31  3.87,42.27 270 bottom
R32  52.84,12.76 90 bottom
R33  44.51,11.94 0 bottom
R44  21.65,11.34 0 bottom
R45  25.41,48.77 0 top
RESET  5.7,49.79 180 top
S1  5.75,3.05 0 top
SV1  22.21,32.11 0 top
SV2  43.55,49.64 0 top
U1  43.29,18.65 0 top
U2  71.44,43.24 225 top
U3  43.29,32.67 0 top
U11  22.46,6.15 270 bottom
U$1  60.67,21.44 270 top
U$2  26.12,21.19 90 top
U$3  55.28,7.68 0 bottom
U$4  48.17,7.68 0 bottom
U$5  38.21,7.68 0 bottom
U$6  30.69,7.68 0 bottom
U$7  33.95,20.68 90 top
UART  61.22,34.55 90 top
USER  16.37,49.89 180 top
X1  17.89,6.66 90 top

### Tracks (layer width: path | path; a pad name or v marks a point on that pad's centre or on a via)
+3V3  (via drill 0.6)
  Top 0.254: 1.91,40.8 R27.1 | R3.1 v8.14,49.79 | C15.1 73.58,51.4 v74.31,50.68 | 74.43,50.55 v74.31,50.68 | I2C_EXT.2 56.91,41.81 56.91,40.65 57.57,39.99 63,39.99 63.61,40.6 63.61,42.63 63.97,42.98 C6.1 65.97,44.83 U2.24 | U2.36 70.51,38.35 70.51,37.76 v70.93,37.34 | U2.48 81.76,42.23 BOOT.1 82.26,42.68 83.53,41.41 83.53,40.18 C5.1 | U2.9 74.18,47.74 74.18,50.55 v74.31,50.68
  Top 0.305: 22.11,43.69 22.36,43.44 22.38,43.44 C8.+ | 1.91,40.8 1.91,39.77 2.8,38.87 3.84,38.87 R29.2 3.82,38.95 v3.82,40.14 | U3.20 U3.19 U3.18 U3.17 U3.16 U3.15 47.44,32.42 C26.2 | C19.2 42.65,15.44 42.28,15.81 42.28,16.76 U1.5 42.32,19.67 | 42.32,19.67 U1.16 U1.15 | 42.32,19.67 42.28,19.63 U1.1
  Top 0.406: v9.92,45.98 21.6,45.98 22.36,45.22 22.36,44.17 C8.+ | 49.07,41.15 R14.2 R13.2 51.22,39.78 v50.3,38.87 | R11.2 81.22,36.14 v81.14,36.23 | C26.2 C27.2 49.63,32.06 50.81,32.06 51.22,31.65 | R17.2 50.2,28.2 | 51.22,31.65 51.22,29.22 50.2,28.2 | 50.2,28.2 50.2,25.15 48.98,23.93 47.97,23.93 47.56,23.53 47.56,20.28 v46.75,19.46 | 51.22,31.65 52.03,30.84 61.12,30.84 UART.1 | v30.69,16.82 30.69,17.42 U$7.20 | 42.28,19.63 42.32,19.63 v43.9,18.04
  Top 0.61: v24.14,41.92 22.73,41.92 | R15.2 62.55,51.87 62.09,51.42 v59.95,51.42 | v71.33,31.05 71.54,31.05 72.55,30.03 76.62,30.03 78.65,32.06 81.49,32.06 v82.31,32.87
  Top 1.27: IC2.3 19.37,39.94 19.57,40.14 21.21,40.14 C11.1 C12.1 22.73,40.57 22.73,41.92 C8.+
  Bottom 0.254: 5.34,43.95 5.34,47 v8.14,49.79 | v70.93,37.34 70.32,37.34 69.71,36.73 69.71,31.76 68.69,30.74 | 51.12,51.82 51.17,51.77 | 33.74,45.76 29.18,45.76 26.43,48.52 23.33,48.52 23.12,48.72 | R25.2 31.24,15.67
  Bottom 0.305: R31.2 3.87,40.19 v3.82,40.14 | U$6.P$5 30.97,6.18 30.69,6.46 30.69,8.9 30.9,9.1 31.38,9.1 U$6.P$8
  Bottom 0.406: v9.92,45.98 7.38,45.98 5.34,43.95 5.34,41.92 4.84,41.41 3.96,41.41 R31.2 | 56.91,40.65 56.91,41.81 I2C_EXT.2 57.01,40.7 56.09,39.78 53.86,39.78 53.25,39.17 53.25,38.56 | UART.1 65.03,30.74 | 53.25,38.56 53.25,38.36 53.86,37.75 58.94,37.75 59.55,37.14 64.22,37.14 65.44,35.92 65.44,31.15 65.03,30.74 | 33.74,45.76 R9.1 | 65.03,30.74 68.69,30.74 | v82.31,32.87 82.31,33.08 81.09,34.3 81.09,36.18 v81.14,36.23 81.33,36.41 R12.2 80.59,36.41 80.07,36.94 80.07,39.17 80.68,39.78 80.68,42.22 81.29,42.83 82.15,42.83 BOOT.1 | v50.3,38.87 50.71,38.87 51.01,38.56 53.25,38.56 | U$5.P$5 38.49,6.18 38.21,6.46 38.21,8.9 38.42,9.1 | 38.42,9.1 38.9,9.1 U$5.P$8 | 43.09,9.51 R26.2 43.7,11.81 R33.2 | U$4.P$5 48.45,6.18 48.17,6.46 48.17,8.9 48.37,9.1 | 48.37,9.1 48.86,9.1 U$4.P$8 | U$3.P$5 55.56,6.18 55.28,6.46 55.28,8.9 55.48,9.1 55.97,9.1 U$3.P$8 56.5,9.09 | 56.5,9.09 58.58,9.09 C31.2 | 35.77,10.52 R30.2 35.77,10.73 34.35,12.15 34.35,15.6 34.76,16.01 36.38,16.01 37.2,15.2 37.2,14.86 R22.2 38.42,13.64 38.42,11.09 C29.2 | 35.77,10.52 R23.2 | C29.2 38.48,11.03 38.48,11.94 38.68,12.15 42.89,12.15 | C29.2 38.58,9.27 38.42,9.1 | 35.77,10.52 31.51,10.52 31.39,10.41 U$6.P$8 31.34,9.14 C28.2 31.34,12.79 R24.2 R25.2 31.3,15.26 31.3,16.21 v30.69,16.82 | 43.09,11.47 R33.2 | R33.2 43.29,11.94 43.09,12.15 42.89,12.15 | R19.2 56.16,13.71 56.5,13.37 56.5,9.09 | R18.2 R19.2 | R19.2 R32.2 52.64,13.91 52.64,14.59 51.83,15.4 R21.2 | 48.37,9.1 48.54,9.27 48.54,10.83 R20.2 48.54,11.03 C30.2 48.54,14.96 R21.2 | R21.2 48.1,16.48 47.76,16.82 46.34,16.82 | 42.89,12.15 43.7,12.96 43.7,16.01 44.51,16.82 46.34,16.82
  Bottom 0.406: 46.34,16.82 46.75,17.23 v46.75,19.46 45.32,19.46 v43.9,18.04
  Bottom 0.61: 50.94,52.71 51.17,52.48 51.17,51.77 SV2.13 SV2.14 | 50.94,52.71 50.81,52.84 27.9,52.84 26.43,51.37 24.95,51.37 23.12,49.54 23.12,48.72 23.12,42.93 v24.14,41.92 | 50.94,52.71 51.06,52.84 59.5,52.84 59.95,52.38 v59.95,51.42 60.01,51.37 63,51.37 63.46,51.82 70.62,51.82 71.38,51.06 73.92,51.06 v74.31,50.68 74.36,50.63 77.35,50.63 77.84,50.15 77.84,48.11 79.06,46.89 79.87,46.89 81.49,45.27 81.49,43.69 82.1,43.08 82.1,42.88 BOOT.1 | 68.69,30.74 71.03,30.74 v71.33,31.05
ADC0  (via drill 0.6)
  Top 0.254: v71.89,46.23 71.95,46.23 U2.10
  Bottom 0.254: v71.89,46.23 71.84,46.29 71.33,46.29 69.5,48.11 69.5,48.32 68.49,49.33 64.83,49.33 64.22,48.72 63.61,48.72 62.6,49.74 61.58,49.74 61.38,49.54 61.38,48.52 59.55,46.69 46.95,46.69 46.09,47.56 SV2.10
ADC1
  Top 0.254: U2.11 72.78,47.89 73.67,48.77 73.67,49.54 72.65,50.55 60.46,50.55 59.95,50.04 59.95,47.5 58.68,46.23 48.78,46.23 47.25,47.76 47.25,49.74 SV2.9
ADC2
  Top 0.254: U2.12 72.44,49.75 72.15,50.04 60.72,50.04 60.46,49.79 60.46,47 59.19,45.73 46.75,45.73 44.71,47.76 44.16,47.76 SV2.8
ADC3
  Top 0.254: U2.13 70.62,48.32 70.62,49.03 70.11,49.54 61.22,49.54 60.97,49.28 60.97,46.49 59.7,45.22 44.46,45.22 42.17,47.5 42.17,49.54 SV2.7
ADC4  (via drill 0.6)
  Top 0.254: U2.14 68.84,49.03 64.53,49.03 64.27,48.77 62.44,48.77 v62.24,48.57
  Bottom 0.254: SV2.5 41.56,50.91 42.17,50.3 42.17,47.5 42.68,47 45.98,47 46.75,46.23 60.11,46.23 61.99,48.11 61.99,48.32 v62.24,48.57
ADC5  (via drill 0.6)
  Top 0.254: v67.88,48.06 69.09,48.06 U2.15
  Bottom 0.254: SV2.4 38.77,48.37 41.41,45.73 45.48,45.73 45.98,45.22 61.48,45.22 65.03,48.77 67.17,48.77 v67.88,48.06
ADC6  (via drill 0.6)
  Top 0.254: v71.13,45.17 71.13,45.3 U2.16
  Bottom 0.254: SV2.3 38.47,50.65 37.09,49.28 37.09,47.5 38.11,46.49 39.63,46.49 40.9,45.22 45.22,45.22 45.73,44.71 62.24,44.71 65.54,48.01 66.81,48.01 67.57,47.25 69.35,47.25 71.13,45.47 v71.13,45.17
ADC7  (via drill 0.6)
  Top 0.254: U2.17 70.11,45.64 70.11,45.07 71.13,44.05 v71.74,44.05
  Bottom 0.254: SV2.2 35.93,47.91 37.86,45.98 39.38,45.98 40.65,44.71 44.97,44.71 45.48,44.2 62.49,44.2 65.8,47.5 66.3,47.5 67.07,46.74 68.84,46.74 70.11,45.47 70.11,45.07 70.32,44.86 70.52,44.66 71.13,44.05 v71.74,44.05
ADC8  (via drill 0.6)
  Top 0.254: v62.24,47.25 62.55,47.25 63,47.71 66.66,47.71 67.47,46.89 68.14,46.89 U2.18
  Bottom 0.254: SV2.6 41.01,47.66 42.17,46.49 45.48,46.49 46.24,45.73 60.72,45.73 v62.24,47.25
AENBL  (via drill 0.6)
  Top 0.254: IO1.10 67.64,13.1 66.86,13.87 64.63,13.87 v64.42,13.67 | U2.26 66.41,41.41 65.03,41.41 64.83,41.21 64.83,39.78 63.66,38.61 63.61,38.61 v63.61,38.41 | v69.1,20.73 68.23,20.73 66.86,22.1 66.86,32.16 v66.41,32.62
  Bottom 0.254: v64.42,13.67 64.42,13.87 69.1,18.55 v69.1,20.73 | v66.41,32.62 66.41,36.18 64.22,38.36 63.66,38.36 v63.61,38.41
APHASE  (via drill 0.6)
  Top 0.254: IO1.13 65.85,5.54 v65.24,6.15 | U2.41 73.84,39.71 74.58,38.97 75.19,38.97 76.21,37.95 77.43,37.95 80.88,34.5 v80.88,33.08
  Bottom 0.254: v65.24,6.15 65.24,11.49 63.51,13.21 63.51,13.98 68.08,18.55 68.08,21.09 68.69,21.7 73.77,21.7 77.63,25.56 77.63,30.44 80.27,33.08 v80.88,33.08
BATT  (via drill 0.6)
  Top 0.61: v8.54,8.49 7.33,8.49 5.9,9.91 2.04,9.91 1.64,9.51 1.64,8.03 JP1.2
  Bottom 0.61: R6.1 9.13,7.9 v8.54,8.49 | D1.C 3.67,15.81 1.84,13.98 JP1.2
  Bottom 1.27: JP1.2 1.84,5.34 | 1.84,5.34 1.84,3.16 S1.1 | S1.2 5.6,3.05 3.31,5.34 1.84,5.34
BENBL  (via drill 0.6)
  Top 0.254: IO1.11 66.99,12.94 66.66,13.27 65.85,13.27 v65.44,12.86 | v65.14,38.92 65.19,38.92 65.44,39.17 65.44,40.8 66.52,40.8 U2.27 | v70.88,20.78 70.42,20.78 69.5,21.7 68.08,21.7 67.47,22.31 67.47,31.5 v67.78,31.81
  Bottom 0.254: v65.44,12.86 65.44,14.13 70.88,19.56 v70.88,20.78 | v65.14,38.92 65.24,38.82 65.24,38.16 67.27,36.13 67.27,32.52 v67.78,31.81
BPHASE  (via drill 0.6)
  Top 0.254: 66.34,11.93 IO1.12 66.24,11.94 v62.7,11.94 | v78.04,35.31 78.04,35.72 76.82,36.94 74.54,36.94 U2.38
  Bottom 0.254: v62.7,11.94 62.7,12.25 62.49,12.45 62.49,14.48 66.86,18.85 66.86,21.7 68.08,22.92 72.76,22.92 76.21,26.37 76.21,30.84 77.84,32.47 77.84,34.3 78.04,34.5 v78.04,35.31
GND  (via drill 0.6)
  Top 0.254: 72.19,8.84 72.31,8.84 v72.35,8.79 | v68.69,8.79 v67.47,8.79 | IO1.21 71.54,4.43 71.64,4.32 74.18,4.32 74.43,4.07 74.43,3.08 C4.1 | U2.47 | U2.8 72.96,45.84 72.96,45.07 73.16,44.86 73.16,44.71 73.29,44.58 | 68.08,43.85 67.68,43.85 66.94,44.58 U2.23 65.8,45.68 65.8,45.72 65.03,46.49 64,46.49 C6.2 64.42,46.98 64.42,47.1 64.63,47.3 66.25,47.3 66.66,46.89 66.7,46.89 U2.20 | U2.35 70.09,38.74 | U2.35 70.93,39.53 70.93,39.99 70.72,40.19 70.72,41.61 71.33,42.22 71.33,42.83 | U2.35 69.61,38.21 69.61,36.84 70.11,36.33 71.74,36.33 72.35,35.72 73.37,35.72 73.57,35.52 73.57,34.09 PROGRAMMING.3 | U2.47 76.66,41.21 77.02,41.21 77.43,41.61 80.39,41.61 C5.2 | 73.29,44.58 U2.47 | 73.29,44.58 73.31,44.61 v73.42,44.61 | 81.9,40.1 C5.2 | C5.2 81.7,39.97 81.7,37.34 81.49,37.14 80.68,37.14 80.27,36.73 80.27,35.72 80.68,35.31 81.09,35.31 81.49,34.91 84.93,34.91 LED2.A | U$7.14 30.13,21.66 29.88,21.9 29.88,23.53 29.96,23.61 U$7.11 32.73,23.61 | 32.73,23.61 U$7.10 | U$7.10 35.24,23.61 | U$7.2 35,18.41 34.76,18.65 33.54,18.65 33.34,18.85 33.34,21.9 | U$7.2 U$7.3 U$7.4 | U$7.2 U$7.1 | U$7.7 34.8,21.66 34.76,21.7 33.54,21.7 33.34,21.9 | 45.12,24.54 v45.32,24.75 | 33.34,21.9 33.34,23 32.73,23.61 | U$7.10 37.89,23.61 38.82,24.54
  Top 0.305: 70.52,8.59 70.32,8.39 | 71.54,8.79 71.74,8.79 72.84,9.89 | 71.54,8.79 v71.13,8.79 71.05,8.79 70.89,8.96 | 67.98,8.69 68.08,8.79 v68.69,8.79 69.1,8.79 | 71.54,8.79 | 71.54,8.19 IO1.21 | v1.53,35.31 1.53,37.16 LED4.A | v3.82,33.28 5.85,33.28 | LED2.A v85.15,36.53 | 54.37,41.81 I2C_EXT.1 | U3.6 U3.5 U3.4 U3.3 U3.2 41.56,33.28 42.28,33.28 42.54,33.55 U3.23 U3.22 | U1.13 44.9,20.5 | 44.9,20.5 45.12,20.28 45.12,19.65 U1.12 U1.11 U1.10 U1.9 45.14,17.05 44.92,16.82 44.29,16.82 U1.8 44.27,14.87 C19.1 44.31,14.75 44.31,14.18 | C18.1 46.17,21.78 44.9,20.5 | U1.4 41.44,16.21 41.24,16.01 C17.1 | 38.82,24.54 39.63,24.54 40.24,23.93 44.51,23.93 v45.32,24.75 | 44.31,13.77 44.1,13.57
  Top 0.406: 71.74,8.79 71.54,8.59 71.54,8.19 72.19,8.84 IO1.3 | IO1.2 72.84,10.09 71.54,8.79 | IO1.5 70.89,8.96 70.52,8.59 | IO1.15 67.64,8.35 67.98,8.69 | IO1.8 68.94,8.96 69.1,8.79 | C21.2 84.78,51.26 C22.2 84.78,47.82 v84.85,47.76 84.27,47.18 R4.2 | I2C_EXT.1 54.47,40.6 55.69,39.38 57.72,39.38 | 57.72,39.38 61.17,39.38 | 61.17,39.38 63.61,39.38 64.22,39.99 64.22,42.32 v65.29,43.39 67.63,43.39 68.08,43.85 68.49,44.25 69.91,44.25 71.33,42.83 71.54,42.63 72.15,42.63 72.76,43.24 72.76,44.46 73.16,44.86 | UART.4 61.22,39.33 61.17,39.38 | v24.29,37.34 23.38,37.34 23.07,37.65 | C27.1 C26.1 45.97,30.4 v45.93,30.44 | v45.32,24.75 44.51,24.75 44.1,25.15 44.1,26.13 C23.1 | R5.2 48.71,25.29 48.17,24.75 v45.32,24.75 | 42.54,33.55 43.03,33.55 v43.5,33.08 | C18.1 46.17,23.9 v45.32,24.75 | v47.76,35.31 51.42,35.31 53.86,37.75 56.09,37.75 57.72,39.38 | v41.92,7.42 41.92,10.57 v42.07,10.73 43.09,10.73 44.31,11.94 44.31,13.77 44.31,14.18 | 44.1,13.57 41.87,13.57 41.26,14.18 41.26,17.49 U1.4
  Top 0.61: X1.5 19.49,7.55 v18.4,6.46 | 6.61,42.68 5.27,44.03 LED12.C 5.34,45.09 5.34,47.25 5.05,47.54 | RESET.2 5.05,47.54 | RESET.1 9.15,47.54 | 9.15,47.54 5.05,47.54 | 9.15,47.54 9.26,47.64 USER.2 USER.1 20.44,47.74 20.44,49.01 LED11.C 23.81,50.93 24.55,50.2 | 48.98,52.84 28.46,52.84 27.95,52.33 27.95,52.28 26.63,50.96 25.31,50.96 24.55,50.2 | 24.55,50.2 24.39,50.04 24.39,49.54 24.65,49.28 24.65,48.96 R45.1 | 24.14,48.52 24.71,48.52 R45.1 | C25.1 71.69,51.87 v72.15,52.33 | Q2MMBF170-7-F.2 24.87,47.03 24.39,47.5 24.39,48.71 R45.1 | 48.98,52.84 48.63,52.48 SV2.11 SV2.12 | 48.98,52.84 v61.22,52.84 | 75.28,51.89 C15.2 76.11,52.33 v76.77,51.67 76.62,51.52 76.62,50.76 v75.19,49.33
  Top 1.27: 63.61,8.79 v67.47,8.79 | 69.1,8.79 63.92,8.79 v63,9.71 62.29,9 C7.- | IC2.2 19.82,37.4 | 19.82,37.4 21.09,37.4 | 21.09,37.4 21.35,37.4 | 21.35,37.4 22.82,37.4 | 22.82,37.4 22.87,37.34 22.87,36.92 C10.2 | C11.2 21.24,37.55 21.09,37.4 | C9.2 21.24,37.29 21.35,37.4 | C12.2 23.12,37.7 23.07,37.65 22.82,37.4 | C8.- 17.89,43.8 16.77,42.68 6.61,42.68 5.85,42.68 5.85,33.28 5.85,32.26 16.27,32.26 16.27,32.77 | 16.27,32.77 16.27,37.85 | 16.27,42.42 16.27,37.85 | 16.27,37.85 16.77,37.34 19.77,37.34 19.82,37.4 | SV1.1 16.93,32.11 16.27,32.77 | v72.35,8.79 72.5,8.64 73.92,8.64 76.72,5.85 C1.2 C2.2
  Bottom 0.305: v1.53,35.31 1.64,35.21 LED3.C 3.34,33.77 v3.82,33.28 | v85.15,36.53 LED1.C
  Bottom 0.406: C16.2 C20.1 8.54,18.04 | v45.32,24.75 45.93,25.36 v45.93,30.44 45.93,32.67 45.53,33.08 | v43.5,33.08 45.53,33.08 | 45.53,33.08 v47.76,35.31 | 32.73,4.43 32.93,4.63 LED6.C 32.52,6.54 32.52,6.66 32.04,7.15 U$6.P$6 | 40.45,5.72 LED5.C | LED8.C 45.73,4.63 45.53,4.43 | U$4.P$6 49.51,7.15 49.79,6.86 49.79,4.63 49.59,4.43 | LED7.C 53.05,4.43 | U$3.P$6 56.83,7.15 | 56.83,7.15 57.11,6.86 57.11,4.63 57.31,4.43 | 56.83,7.15 58.82,7.15 C31.1 | C28.1 28.46,10.73 28.05,10.32 28.05,4.43 | 51.22,7.27 51.22,9.3 51.62,9.71 51.62,12.55 51.01,13.16 C30.1 | 51.22,7.27 51.22,4.43 | v51.27,7.63 51.27,7.32 51.22,7.27 | U$5.P$6 39.35,7.15 39.84,6.66 39.84,6.33 LED5.C | v41.92,7.42 41.92,6.79 LED5.C | v42.07,10.73 40.48,10.73 C29.1
  Bottom 0.61: C14.2 22.46,9.16 U11.2 22.46,6.36 22.67,6.15 | R10.2 18.4,4.77 | 19.52,5.14 R10.2 | 22.67,6.15 21.14,6.15 20.23,5.24 19.99,5.24 R10.2 | v18.4,6.46 18.4,4.77 | 77.23,52.33 v72.15,52.33 71.64,52.84 v61.22,52.84 | 77.23,52.33 83.92,52.33 C21.2 84.88,47.8 v84.85,47.76 | 22.67,6.15 25.27,6.15 C13.2 | v75.19,49.33 73.37,47.5 73.37,44.66 v73.42,44.61 | v76.77,51.67 76.77,51.87 77.23,52.33 | 11.8,5.65 17.52,5.65 18.4,4.77
  Bottom 1.27: v63,9.71 63,7.27 60.16,4.43 57.31,4.43 53.05,4.43 51.22,4.43 49.59,4.43 45.53,4.43 32.73,4.43 28.05,4.43 25,1.38 12.2,1.38 11.8,1.78 11.8,5.65 10.98,6.46 5.9,6.46 5.09,7.27 5.09,8.54 | SV1.1 19.52,32.26 11.69,32.26 8.54,29.11 8.54,18.04 v8.54,11.54 8.54,11.33 6.11,8.9 5.45,8.9 5.09,8.54 | 5.09,8.54 JP1.1
  other vias: 77.23,7.93 75.19,7.93 75.19,10.01 77.23,10.01 69.91,8.8 13.02,21.09 4.48,21.09 7.53,31.5 14.39,31.5 14.13,43.69 7.53,43.69 10.83,43.69 10.83,31.25 5.5,49.79 19.98,49.79 4.48,25.66 4.48,18.04 1.94,17.02 1.94,21.09 1.94,25.66 13.02,17.02 20.64,17.02 20.64,21.09 79.26,7.93 79.26,9.96 28.51,37.45 27.04,18.8 59.8,18.4 82.05,21.19 84.85,21.19 84.8,25.76 82.05,25.76 82.05,17.13 84.59,17.13 80.02,54.31 55.94,32.82 36.03,44.81 37.45,37.09 33.18,41.76 5.7,53.45 14.64,51.01 71.38,39.33 27.09,23.88 59.8,24.29 13.02,25.97 75.75,21.39 64.37,21.8 70.88,26.17 64.37,26.17 72.5,16.92 84.19,2.7 7.33,6.05 48.37,18.45 36.84,24.9 52.08,24.9 38.21,30.03 28.51,30.99 52.89,29.57 53.1,16.36
  pour Bottom: -13.2,69.04 95.11,69.04 95.11,-9.19 -13.2,-9.19
  pour Top: -4.66,73.92 89.83,73.92 89.83,-5.94 -4.66,-5.94
IR_CONTROLL  (via drill 0.6)
  Top 0.254: v69.5,43.19 69.5,42.38 U2.29
  Bottom 0.254: SV2.1 35.16,50.91 34.81,50.55 34.81,47.25 35.32,46.74 36.08,46.74 37.6,45.22 39.38,45.22 40.4,44.2 44.71,44.2 45.22,43.69 62.85,43.69 65.85,46.69 66.25,46.69 66.86,46.08 68.69,46.08 69.5,45.27 v69.5,43.19
LED_1  (via drill 0.6)
  Top 0.254: 67.61,41.14 U2.28 66.46,40.02 v66.46,39.82 | v54.67,38.77 53.86,38.77 52.44,37.34 50.2,37.34 47.56,39.99 47.56,40.39 v47.36,40.6 | 31.29,44.25 R28.2 31.29,43.85 32.93,43.85 34.96,41.81 v40.45,41.81
  Bottom 0.254: v66.46,39.82 66.08,40.19 64.42,40.19 63.82,39.58 57.72,39.58 56.91,38.77 v54.67,38.77 | v47.36,40.6 41.67,40.6 v40.45,41.81
LEFT_ENC  (via drill 0.6)
  Top 0.254: LED4.C 1.96,34.09 1.96,33.36 | R29.1 3.87,35.36 v3.82,35.31 | v70.52,28 69.91,28.61 69.91,31.65 70.32,32.06 73.16,32.06 v73.37,31.86 | U2.3 76.56,45.88 77.23,45.88 77.84,45.27 v78.04,45.27
  Top 0.305: 1.64,34.09 LED4.C 1.66,33.79 2.8,33.79 3.06,34.04 3.06,35.82 3.87,36.63 R29.1
  Bottom 0.254: v3.82,35.31 19.72,35.31 23.99,39.58 28.86,39.58 31.1,37.34 34.15,37.34 35.37,38.56 39.02,38.56 40.24,37.34 47.97,37.34 49.18,36.13 50.81,36.13 52.44,34.5 56.09,34.5 56.5,34.91 56.91,34.91 57.52,34.3 57.52,28.81 58.13,28.2 70.32,28.2 v70.52,28 | v73.37,31.86 74.38,31.86 74.79,32.26 74.79,35.72 76.01,36.94 78.04,36.94 78.65,37.55 78.65,39.58 77.84,40.39 77.84,41.41 79.06,42.63 79.06,44.25 v78.04,45.27
M1  (via drill 0.6)
  Top 0.254: IO1.14 66.99,4.5 66.81,4.32 65.8,4.32 65.29,4.83 64.32,4.83 v64.22,4.93 | U2.40 73.53,39.41 75.4,37.55 77.02,37.55 79.66,34.91 79.66,34.3 v79.87,34.09
  Bottom 0.254: v79.87,34.09 79.87,33.48 77.02,30.64 77.02,25.97 73.37,22.31 68.49,22.31 67.57,21.39 67.57,18.8 63,14.23 63,12.96 64.22,11.74 v64.22,4.93
N$1
  Top 0.305: IO1.4 71.54,14.08
  Top 0.406: 71.54,14.08
  Top 0.61: 71.54,14.08 71.54,14.89 68.69,17.74 63.05,17.74 61.67,19.12 U$1.P$1
N$2
  Top 0.305: IO1.6 70.24,14.77
  Top 0.406: 70.24,14.77 69.1,15.91
  Top 0.61: 69.1,15.91 68.29,16.72 68.26,16.7 61.92,16.7 U$1.P$2
N$3
  Top 0.305: IO1.9 68.29,13.87
  Top 0.406: 68.29,13.87 67.57,14.59 67.47,14.69
  Top 0.61: 67.57,14.59 67.17,14.99 64.27,14.99 60.36,11.08 60.36,7.27 58.13,5.04 29.27,5.04 29.04,5.26 28.99,5.26 26.43,7.83 26.43,15.37 25.61,16.19 U$2.P$1
N$4
  Top 0.305: IO1.7 69.59,13.79
  Top 0.406: 69.59,13.79 67.68,15.7
  Top 0.61: 67.88,15.5 67.68,15.7 67.47,15.91 63.66,15.91 59.95,12.2 59.95,12.17 59.19,11.41 59.19,7.65 57.87,6.33 57.82,6.33 57.54,6.05 29.68,6.05 27.7,8.03 27.7,8.08 27.34,8.44 27.34,16.11 25.16,18.29 25.16,26.16 U$2.P$2
N$5
  Top 0.254: IO1.17 68.94,4.67 68.59,4.32 68.34,4.32 67.83,3.82 67.83,3.31 67.57,3.05 66.78,3.05 C3.2
N$6
  Top 0.305: U3.7 42.04,30.61 40.85,29.42 40.85,26.37 41.06,26.17 C23.2
N$7
  Top 0.305: U3.8 42.54,28.3 C24.2
N$8
  Top 0.305: IO1.24 IO1.23 IO1.22
N$9  (via drill 0.6)
  Top 0.254: R1.2 81.7,6.97 v81.29,7.37
  Top 0.305: IO1.1 74.18,12.04 v74.58,11.64
  Bottom 0.254: 81.29,10.22 v81.29,7.37
  Bottom 0.305: 81.29,10.22 80.58,10.93 78.5,10.93 77.58,11.84 74.79,11.84 v74.58,11.64
N$13
  Top 0.305: U3.9 43.04,29.47 43.09,29.42 43.7,29.42 43.9,29.22 43.9,28.44 C24.1
N$14
  Bottom 0.254: 1.76,37.14 LED3.A 1.74,37.37
  Bottom 0.305: 1.74,37.37 1.74,40.09 1.79,40.14 1.79,41.92 3.09,43.22 R31.1
N$15
  Bottom 0.254: 83.1,34.51 84.99,34.51 LED1.A
  Bottom 0.305: 85.08,34.75 LED1.A
  Bottom 0.406: R12.1 83.1,34.51 | 85.13,34.7 LED1.A
N$16  (via drill 0.6)
  Top 0.254: R4.1 81.71,45.28 79.87,43.44 77.63,43.44 v77.43,43.24 | v73.57,42.63 73.57,42.18 U2.44 | 84.85,42.98 84.85,42.78 BOOT.2
  Top 0.406: R4.1 84.53,45.28 84.85,44.96 84.85,42.98
  Bottom 0.254: v77.43,43.24 74.18,43.24 v73.57,42.63
N$17
  Bottom 0.254: U11.1 21.42,7.52 21.35,7.6
  Bottom 0.305: 21.52,7.6 21.35,7.6 20.61,7.6 20.53,7.68 20.53,10.96 R44.2
N$18
  Top 0.254: R17.1 46.2,28.81 45.73,28.81 44.71,29.83 43.9,29.83 43.54,30.19 U3.10
  Top 0.305: 46.34,28.67 R17.1 R5.1
N$19
  Top 0.305: U1.14 43.62,21.86 C18.2 R16.2
N$20
  Top 0.305: C17.2 38.38,18.41 39.63,19.67 39.63,21.84 R16.1
N$21
  Bottom 0.406: U$6.P$3 U$6.P$4
N$22
  Top 0.254: IO1.20 70.89,3.83 C4.2
N$23
  Top 0.305: R27.2 1.84,44.94 LED12.A
N$24  (via drill 0.6)
  Top 0.305: v22.77,14.38 22.77,12.76 v24.19,11.33
  Bottom 0.254: LED13.C 22.18,13.8 v22.77,14.38
  Bottom 0.406: R44.1 v24.19,11.33
N$25
  Bottom 0.406: U$5.P$4 U$5.P$3
N$26
  Top 0.406: SV1.3 24.75,34.25 25.61,35.11 25.61,43.76 Q2MMBF170-7-F.3
  Bottom 0.61: SV1.3 24.75,29.59 R2.1
N$27
  Bottom 0.406: U$4.P$3 U$4.P$4
N$28
  Bottom 0.406: U$3.P$3 U$3.P$4
N$33  (via drill 0.6)
  Top 0.254: LED11.A 22.36,46.29 23.18,45.47 v24.39,45.47 | v27.65,43.44 28.78,43.44 R28.1
  Bottom 0.254: v24.39,45.47 24.8,45.07 24.8,44.46 25.61,43.64 27.44,43.64 v27.65,43.44
N$38
  Bottom 0.406: LED5.A 41.95,9.02 42.89,8.08 43.56,8.08 R26.1
N$39
  Bottom 0.406: LED6.A 33.82,9.22 34.35,8.69 34.35,7.68 34.55,7.47 35.71,7.47 R30.1
N$40
  Bottom 0.406: R32.1 52.84,9.43 LED7.A
N$41
  Bottom 0.406: LED8.A 45.66,9.09 45.66,11.74 R33.1
N$53
  Bottom 0.254: LED13.A 13.58,10.75 R6.2
  Bottom 0.61: U11.3 23.43,7.52 23.89,7.98 23.89,9.16 C14.1 24.13,9.2 25.41,9.2 25.72,9.51 25.72,12.25 25.11,12.86 19.92,12.86 17.77,10.7 R6.2
N$54
  Bottom 0.61: U11.5 21.52,3.18 21.14,2.8 19.58,2.8 R10.1
N$55  (via drill 0.6)
  Top 0.305: R7.1 26.63,41.81 26.43,41.61 26.43,30.84 25.61,30.03 25.41,30.03 17.08,21.7 v17.08,15.81 17.09,15.79 X1.2
  Bottom 0.305: C20.2 17.08,17.87 v17.08,15.81
N$56  (via drill 0.6)
  Top 0.305: R8.1 28.68,39.78 27.24,39.78 27.04,39.58 27.04,30.03 26.43,29.42 25.82,29.42 18.3,21.9 v18.3,19.87 18.3,15.2 17.89,14.79 X1.3
  Bottom 0.305: C16.1 v18.3,19.87
N$57  (via drill 0.6)
  Top 0.406: 16.27,9.64 X1.1
  Top 0.61: 16.27,9.64 16.27,7.68 16.88,7.07 16.88,5.54 17.79,4.63 19.92,4.63 21.14,5.85 23.86,5.85 24.32,5.39 24.32,2.88 v24.24,2.8 | v14.84,16.01 14.84,13.57 16.27,12.15 16.27,9.69 X1.1
  Bottom 0.61: C13.1 U11.4 24.22,4.78 24.32,4.68 24.32,2.88 v24.24,2.8 | D1.A 14.64,15.81 v14.84,16.01
OSCIN
  Top 0.254: C22.1 81.39,49.38 81.04,49.03 81.04,47.56 Q1.3 | Q1.3 81.02,48.54 | Q1.3 81.02,46.72 80.58,46.29 77.63,46.29 77.18,46.74 76.02,46.74 U2.5
OSCOUT
  Top 0.254: C21.1 82.87,51.37 81.8,50.3 78.86,50.3 | Q1.1 78.62,50.54 78.86,50.3 | 78.86,50.3 78.86,49.95 76.21,47.3 75.86,47.3 U2.6
RESET  (via drill 0.6)
  Top 0.254: 65.63,52.33 R15.1 | 8.36,52.04 RESET.3 9.66,52.05 9.66,53.09 10.17,53.6 60.36,53.6 60.77,54.01 64.63,54.01 65.58,53.06 R15.1 | 68.78,52.27 69.1,52.72 69.1,53.09 69.61,53.6 76.62,53.6 77.63,52.58 77.63,50.15 v76.62,49.13 76.62,48.78 U2.7 | 68.78,52.27 C25.2 | R15.1 68.38,51.87 68.78,52.27
  Top 0.305: RESET.4 RESET.3
  Bottom 0.254: PROGRAMMING.1 68.44,39.12 69.5,40.19 74.58,40.19 77.02,37.75 77.63,37.75 78.24,38.36 78.24,39.17 76.82,40.6 76.82,42.02 77.02,42.22 77.84,42.22 78.45,42.83 78.45,43.64 75.4,46.69 75.4,47.91 v76.62,49.13
RIGHT_ENC  (via drill 0.6)
  Top 0.254: 75.26,41.14 U2.45 76.65,39.78 80.07,39.78 80.68,39.17 80.68,38.36 v80.88,38.16 | v85.56,39.78 85.56,39.4 84.74,38.59 LED2.C 84.98,38 82.8,38
  Top 0.305: LED2.C 85.03,38.18 | 82.8,38 R11.1
  Bottom 0.254: v80.88,38.16 80.88,39.17 81.7,39.99 85.35,39.99 v85.56,39.78
SCL  (via drill 0.6)
  Top 0.254: R14.1 49.07,43.19 47.25,43.19 v47,42.93 46.49,42.42 46.14,42.42 43.54,39.83 43.54,36.33 U3.21 | I2C_EXT.3 59.55,43.85 59.19,44.2 53.1,44.2 52.84,43.95 52.84,40.14 v52.33,39.63 | 73.51,40.8 U2.42 73.31,41 v72.35,41 | U$7.18 29.88,19.06 v29.47,19.46
  Top 0.305: U1.2 40.53,18.98 40.24,19.26 40.24,20.28 v40.85,20.89 | v44.31,36.33 43.54,36.33 | v36.79,26.78 39.02,26.78 v40.85,24.95
  Bottom 0.254: I2C_EXT.3 59.55,40.39 59.95,39.99 63.21,39.99 63.61,40.39 63.61,41.81 64.02,42.22 68.49,42.22 69.71,41 v72.35,41 | v47,42.93 47.66,42.93 50.61,39.99 51.98,39.99 v52.33,39.63
  Bottom 0.305: v40.85,20.89 v40.85,24.95 40.85,35.31 41.87,36.33 v44.31,36.33 | v29.47,19.46 32.32,19.46 32.52,19.67 32.52,22.51 v36.79,26.78
SCL0  (via drill 0.6)
  Top 0.254: U$7.6 34.68,21.01 v34.55,20.89 | v55.08,10.52 51.62,10.52 50.81,11.33 50.81,18.65 51.22,19.06 51.22,20.68 v52.03,21.49
  Bottom 0.254: 54.58,11.31 54.58,11.02 v55.08,10.52 | v34.55,20.89 37.4,20.89 37.81,20.48 37.81,19.06 37.4,18.65 37.4,17.23 38.82,15.81 40.65,15.81 42.07,17.23 42.07,19.06 44.1,21.09 44.1,21.49 44.31,21.7 48.37,21.7 49.18,20.89 51.62,20.89 52.03,21.29 v52.03,21.49
  Bottom 0.406: U$3.P$1 54.58,11.31 R19.1
SCL1  (via drill 0.6)
  Top 0.254: U$7.9 38.58,22.96 v38.62,22.92 | v49.59,22.92 49.59,16.41 46.95,13.77 v46.34,13.77
  Bottom 0.254: R21.1 46.2,14.93 46.54,14.59 | 46.54,14.18 v46.34,13.77 | v38.62,22.92 38.82,22.92 39.02,22.71 39.02,18.65 38.62,18.24 38.62,17.63 39.43,16.82 40.04,16.82 40.85,17.63 40.85,19.26 42.89,21.29 42.89,22.71 43.09,22.92 v49.59,22.92
  Bottom 0.406: U$4.P$1 47.47,9.6 46.95,10.12 46.95,13.77 46.54,14.18 46.54,14.59 46.54,15.06 R21.1
SCL2  (via drill 0.6)
  Top 0.254: v35.77,14.99 35.57,15.2 34.55,15.2 33.94,15.81 33.94,17.23 33.74,17.43 32.73,17.43 32.32,17.84 32.32,21.9 31.91,22.31 U$7.13
  Bottom 0.254: R23.1 v35.77,14.99
  Bottom 0.406: U$5.P$1 37.51,9.8 37.2,10.12 37.2,12.15 36.59,12.76 36.32,12.76 R23.1 35.91,13.16
SCL3  (via drill 0.6)
  Top 0.254: U$7.16 28.74,20.36 28.26,19.87 28.26,17.84 29.07,17.02 v29.07,16.62
  Top 0.406: v28.86,9.1 v28.86,12.35
  Bottom 0.254: R25.1 29.34,15.94
  Bottom 0.305: v29.07,16.62 29.07,16.21 29.34,15.94
  Bottom 0.406: U$6.P$1 29.29,9.08 v28.86,9.1 | v28.86,12.35 28.86,14.72 R25.1
SDA  (via drill 0.6)
  Top 0.254: 51.32,43.95 51.32,44.46 51.57,44.71 61.48,44.71 62.24,43.95 62.24,42.07 I2C_EXT.4 | 51.32,43.95 51.32,43.22 R13.1 | U2.43 76.26,38.77 77.02,38.77 v77.23,38.97 | U3.24 42.07,34.58 42.07,35.31 42.28,35.52 42.89,35.52 43.07,35.7 43.07,36.53 43.09,36.55 43.09,40.39 47.15,44.46 50.61,44.46 51.12,43.95 51.32,43.95 | U$7.19 30.04,18.41 v29.47,17.84
  Top 0.305: U1.3 40.12,18.33 v39.63,17.84 | v40.24,36.33 42.87,36.33 43.07,36.53
  Bottom 0.254: I2C_EXT.4 62.24,42.07 62.24,42.27 65.03,45.07 66.25,45.07 69.91,41.41 70.93,41.41 71.54,42.02 72.76,42.02 73.16,41.61 74.58,41.61 v77.23,38.97
  Bottom 0.305: v39.63,17.84 39.63,23.73 | 39.63,23.73 39.63,35.72 v40.24,36.33 | 39.63,23.73 39.02,24.34 38.42,24.34 36.79,22.71 33.74,22.71 33.13,22.1 33.13,18.65 32.32,17.84 v29.47,17.84
SDA0  (via drill 0.6)
  Top 0.254: U$7.5 35.65,20.36 v34.76,19.46 | v57.52,10.12 56.91,10.12 55.69,11.33 51.83,11.33 51.42,11.74 51.42,18.45 52.03,19.06 52.03,19.46 v52.64,20.07
  Top 0.406: v57.31,8.08 57.31,9.91 v57.52,10.12
  Bottom 0.254: v34.76,19.46 36.38,19.46 36.79,19.06 36.79,17.23 38.62,15.4 41.06,15.4 42.48,16.82 42.48,18.85 44.31,20.68 48.58,20.68 49.18,20.07 v52.64,20.07
  Bottom 0.406: v57.31,8.08 56.01,8.08 U$3.P$7 | 57.92,10.93 R18.1 57.92,10.52 v57.52,10.12
SDA1  (via drill 0.6)
  Top 0.254: v50.2,9.1 50.2,21.49 v50.61,21.9 | U$7.8 37.6,22.31 v38.21,21.7
  Bottom 0.254: R20.1 50.34,9.24 v50.2,9.1 | v50.61,21.9 48.98,21.9 48.58,22.31 43.7,22.31 43.5,22.1 43.5,21.09 41.46,19.06 41.46,17.43 40.24,16.21 39.23,16.21 38.01,17.43 38.01,18.65 38.21,18.85 v38.21,21.7
  Bottom 0.406: R20.1 50.34,8.83 49.59,8.08 48.9,8.08 U$4.P$7
SDA2  (via drill 0.6)
  Top 0.254: v40.85,13.16 38.62,13.16 36.79,14.99 36.79,15.6 36.38,16.01 34.76,16.01 34.55,16.21 34.55,17.43 33.94,18.04 32.93,18.04 32.73,18.24 32.73,22.31 32.08,22.96 U$7.12
  Top 0.406: v40.65,7.27 40.65,12.96 v40.85,13.16
  Bottom 0.254: R22.1 40.04,13.98 v40.85,13.16
  Bottom 0.406: U$5.P$7 39.4,8.12 39.84,7.68 40.24,7.68 v40.65,7.27
SDA3  (via drill 0.6)
  Top 0.254: v32.73,16.41 32.73,16.62 31.91,17.43 31.91,20.89 31.79,21.01 U$7.15
  Top 0.406: v33.34,7.47 v33.34,11.54
  Bottom 0.254: R24.1 33.07,16.07 v32.73,16.41
  Bottom 0.406: U$6.P$7 32.69,8.12 v33.34,7.47 | v33.34,11.54 33.34,12.69 R24.1
SERVO  (via drill 0.6)
  Top 0.254: 27.44,46.84 Q2MMBF170-7-F.1 28.05,46.2 v28.05,45.27 | v74.79,31.05 76.41,31.05 78.65,33.28 v78.65,33.89 | v80.07,45.07 79.26,45.07 78.45,44.25 77.63,44.25 76.82,45.07 76.46,45.07 U2.2
  Top 0.406: 26.61,48.52 R45.2 26.58,48.77 27.44,47.91 27.44,46.84
  Bottom 0.254: v78.65,33.89 78.65,34.5 79.46,35.31 79.46,39.78 79.87,40.19 79.87,44.86 v80.07,45.07 | v74.79,31.05 72.76,31.05 71.74,30.03 63.21,30.03 62.6,29.42 59.75,29.42 59.14,30.03 59.14,34.3 58.53,34.91 58.53,36.13 58.13,36.53 56.5,36.53 55.28,35.31 52.84,35.31 51.22,36.94 49.59,36.94 48.17,38.36 40.65,38.36 38.21,40.8 38.21,41.81 38.01,42.02 35.98,42.02 35.57,41.61 35.57,40.39 33.34,38.16 31.71,38.16 28.66,41.21 28.66,44.66 v28.05,45.27
SWCLK
  Top 0.254: PROGRAMMING.4 76.06,34.74 U2.37
SWDIO
  Top 0.254: U2.34 68.59,37.91 68.59,36.84 70.98,34.45 PROGRAMMING.2
UART_RX
  Top 0.254: U2.31 66.05,37.49 66.05,36.33 63,33.28 UART.2
UART_TX
  Top 0.254: U2.30 63.66,35.82 UART.3
USBDM  (via drill 0.6)
  Top 0.254: U2.32 66.66,37.38 66.66,36.13 64.22,33.69 v64.22,32.47 | v31.91,41.61 30.12,41.61 R7.2
  Bottom 0.254: v31.91,41.61 31.3,41 31.3,39.38 31.91,38.77 33.13,38.77 34.96,40.6 34.96,42.02 35.57,42.63 38.62,42.63 38.82,42.42 38.82,41.21 41.06,38.97 48.17,38.97 49.79,37.34 51.42,37.34 53.05,35.72 54.67,35.72 56.09,37.14 58.33,37.14 59.14,36.33 59.14,35.11 59.75,34.5 63.41,34.5 64.22,33.69 v64.22,32.47
USBDP  (via drill 0.6)
  Top 0.254: U2.33 67.07,37.11 67.07,35.92 65.64,34.5 65.64,31.86 65.03,31.25 63.21,31.25 62.39,32.06 59.55,32.06 59.14,32.47
  Top 0.305: v32.32,39.58 30.78,39.58 R8.2 | 59.14,32.47 59.14,36.13 58.53,36.73 v54.06,36.73
  Bottom 0.254: R9.2 34.37,43.24 39.02,43.24 39.43,42.83 39.43,41.61 41.26,39.78 47.97,39.78 50,37.75 52.23,37.75 53.05,36.94 53.86,36.94 v54.06,36.73
  Bottom 0.305: 32.33,39.59 v32.32,39.58
  Bottom 0.406: R9.2 34.15,41.41 v32.32,39.58
USER_KEY_1  (via drill 0.6)
  Top 0.254: USER.3 18.87,52.14 v18.04,51.31 16.52,49.79 R3.2 | U2.46 76.56,40.6 78.65,40.6 v78.85,40.8
  Top 0.305: 20.28,52.08 USER.3
  Bottom 0.254: v18.04,51.31 18.04,45.98 23.89,40.14 28.92,40.14 31.3,37.75 33.74,37.75 35.77,39.78 38.42,39.78 40.45,37.75 48.17,37.75 49.39,36.53 51.01,36.53 52.64,34.91 55.69,34.91 56.3,35.52 57.11,35.52 58.13,34.5 58.13,29.22 58.53,28.81 62.8,28.81 63.41,29.42 71.94,29.42 72.96,30.44 73.98,30.44 74.38,30.03 75.19,30.03 75.6,30.44 75.6,31.65 76.01,32.06 76.62,32.06 77.23,32.67 77.23,35.72 77.84,36.33 78.65,36.33 79.06,36.73 79.06,40.6 v78.85,40.8
VCC
  Top 0.254: C7.+ 62.29,1.48 62.39,1.38
  Top 0.305: IO1.19 70.24,3.45 C3.1 69.59,2.8 IO1.18
  Top 0.406: 10.98,8.39 10.68,8.39 10.58,8.49
  Top 1.27: 69.5,2.68 C3.1 69.35,2.57 69.35,1.28 69.1,1.02 | 62.39,1.38 62.9,1.38 63.26,1.02 69.1,1.02 | IC2.1 21.13,34.86 C9.1 22.11,34.97 | 22.11,34.97 C10.1 | 22.11,34.97 22.21,34.87 SV1.2 22.16,32.06 22.16,29.62 21.55,29.01 12,29.01 10.58,27.59 10.58,8.49 10.58,3.41 10.27,3.11 | 69.1,1.02 76.21,1.02 76.72,1.53 C1.1 C2.1 R1.1 | C7.+ 61.01,3.82 27.44,3.82 25,1.38 12,1.38 10.27,3.11 | S1.3 10.22,3.05 10.27,3.11
  Bottom 0.61: R2.2 22.58,30.52 22.36,30.74
  Bottom 1.27: 22.36,30.23 22.36,30.74 22.36,31.96 SV1.2
(copper drawn outside any net)
  shapes: Top area x5